# Altium project Sitara_Project_Rev_A.PrjPcb (part 1 of 3)
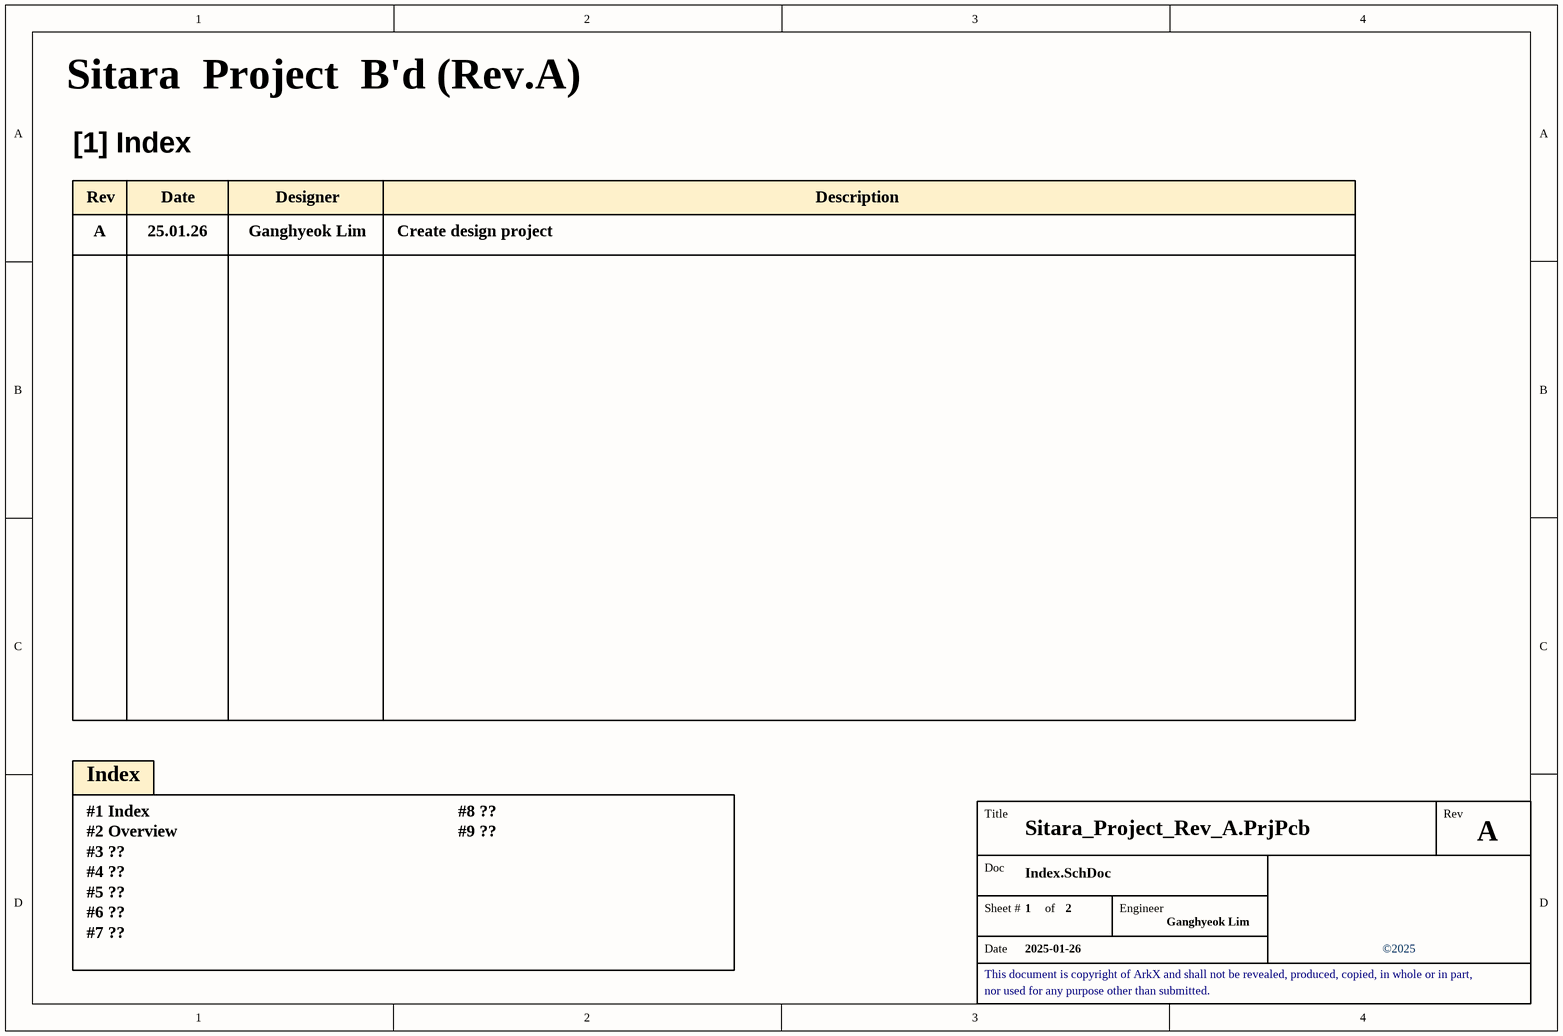
[diagram p0: Index.SchDoc]
11 sheets, 515 parts. Net scope: flat (ports and power ports of the same name join across sheets).
Board file: Sitara_Project_Rev_A.PcbDoc
Sheets:
  Index.SchDoc
  Overview.SchDoc
  Power.SchDoc
  Sitara_Power.SchDoc
  Sitara_AUX.SchDoc
  Sitara_DDR.SchDoc
  Sitara_IO_Bank_123.SchDoc
  Sitara_IO_Bank_45.SchDoc
  Sitara_IO_Bank_6.SchDoc
  Sitara_Connectors.SchDoc
  Sch_Design_Check_List.SchDoc

## Sheet Index.SchDoc
size A4; Date: 2025-01-26; Engineer: Ganghyeok Lim; Revision: A; SheetNumber: 1; SheetTotal: 2

### Notes on the sheet
- Sitara  Project  B'd (Rev.A)
- [1] Index
- Rev
- A
- 25.01.26
- Date
- Ganghyeok Lim
- Designer
- Create design project
- Description
- Index
- #1 Index
- #2 Overview
- #8 ??
- #9 ??
- #3 ??
- #4 ??
- #5 ??
- #6 ??
- #7 ??
- Title
- Doc
- Sheet #
- of
- Engineer
- This document is copyright of ArkX and shall not be revealed, produced, copied, in whole or in part,
- ©2025
- nor used for any purpose other than submitted.

## Sheet Overview.SchDoc
size A4; Date: 2025-01-26; Engineer: Ganghyeok Lim; Revision: A; SheetNumber: 2; SheetTotal: 2
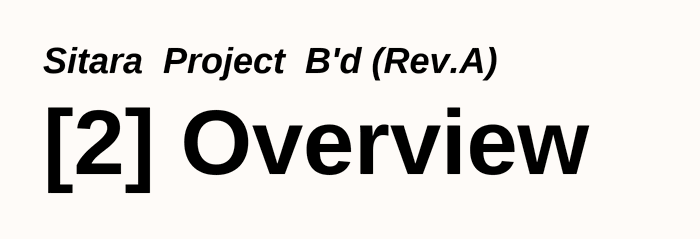
[diagram p1: Overview.SchDoc]

### Notes on the sheet
- Sitara  Project  B'd (Rev.A)
- [2] Overview
- Title
- Rev
- Doc
- Sheet #
- of
- Engineer
- This document is copyright of ArkX and shall not be revealed, produced, copied, in whole or in part,
- Date
- nor used for any purpose other than submitted.

## Sheet Power.SchDoc
size A3; SheetNumber: 3; SheetTotal: 11
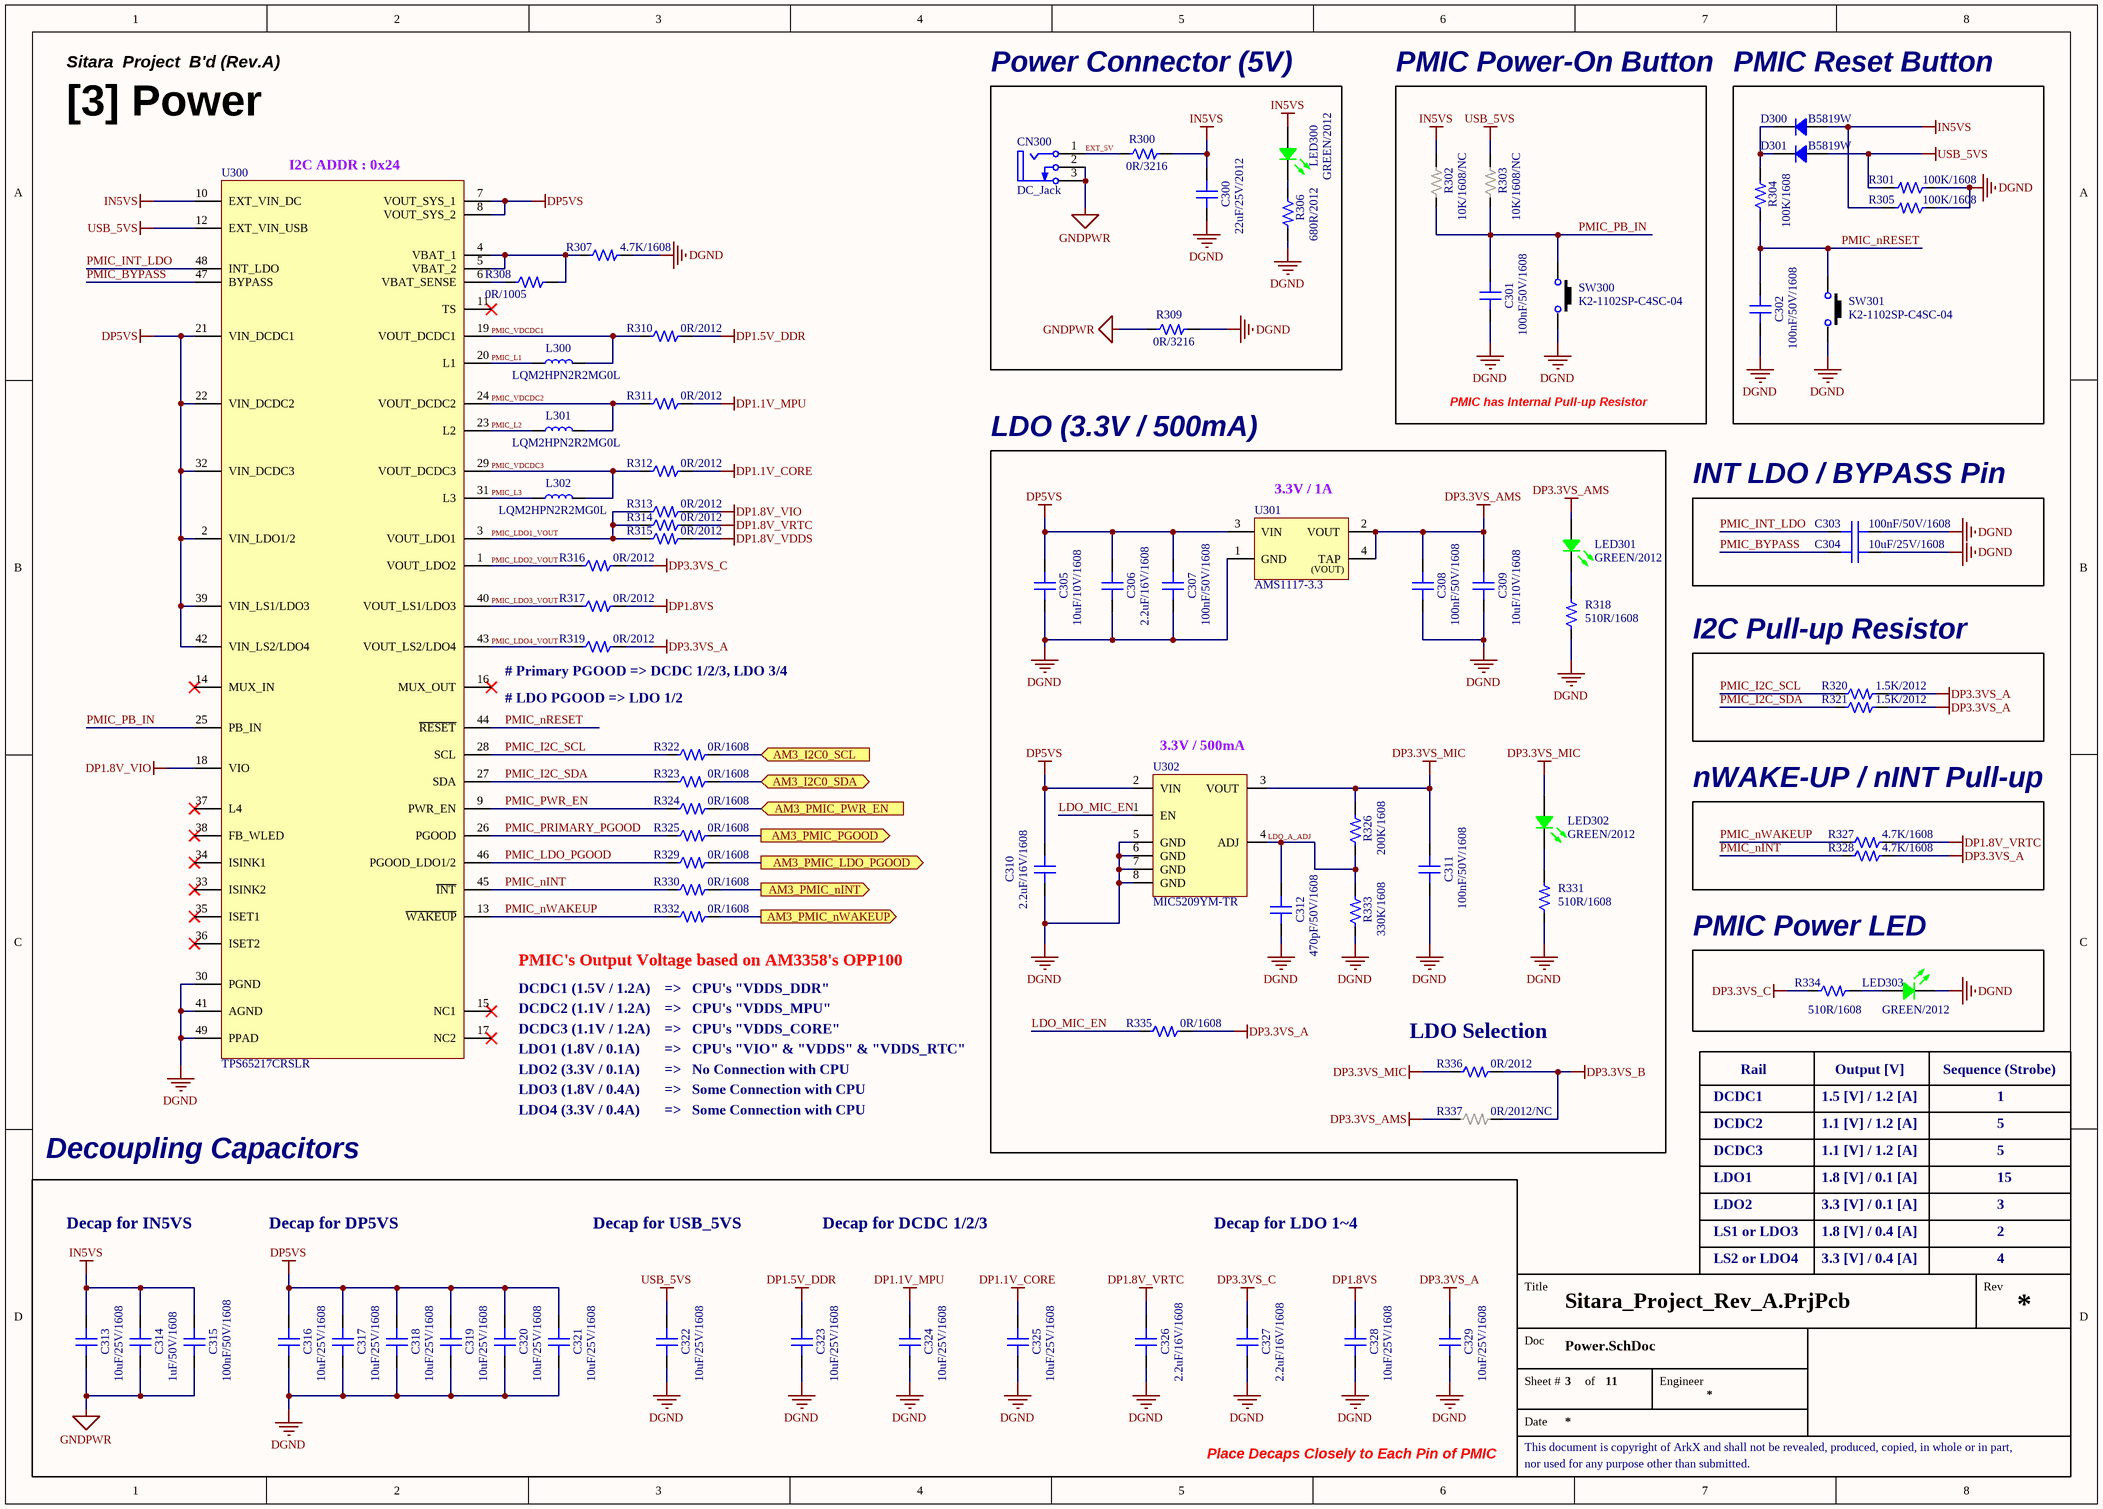
[diagram p2: Power.SchDoc]

### Parts
C300  22uF/25V/2012  [CAP 2012 (0805_INCH)]
C301  100nF/50V/1608  [CAP 1608 (0603_INCH)]
C302  100nF/50V/1608  [CAP 1608 (0603_INCH)]
C303  100nF/50V/1608  [CAP 1608 (0603_INCH)]
C304  10uF/25V/1608  [CAP 1608 (0603_INCH)]
C305  10uF/10V/1608  [CAP 1608 (0603_INCH)]
C306  2.2uF/16V/1608  [CAP 1608 (0603_INCH)]
C307  100nF/50V/1608  [CAP 1608 (0603_INCH)]
C308  100nF/50V/1608  [CAP 1608 (0603_INCH)]
C309  10uF/10V/1608  [CAP 1608 (0603_INCH)]
C310  2.2uF/16V/1608  [CAP 1608 (0603_INCH)]
C311  100nF/50V/1608  [CAP 1608 (0603_INCH)]
C312  470pF/50V/1608  [CAP 1608 (0603_INCH)]
C313  10uF/25V/1608  [CAP 1608 (0603_INCH)]
C314  1uF/50V/1608  [CAP 1608 (0603_INCH)]
C315  100nF/50V/1608  [CAP 1608 (0603_INCH)]
C316  10uF/25V/1608  [CAP 1608 (0603_INCH)]
C317  10uF/25V/1608  [CAP 1608 (0603_INCH)]
C318  10uF/25V/1608  [CAP 1608 (0603_INCH)]
C319  10uF/25V/1608  [CAP 1608 (0603_INCH)]
C320  10uF/25V/1608  [CAP 1608 (0603_INCH)]
C321  10uF/25V/1608  [CAP 1608 (0603_INCH)]
C322  10uF/25V/1608  [CAP 1608 (0603_INCH)]
C323  10uF/25V/1608  [CAP 1608 (0603_INCH)]
C324  10uF/25V/1608  [CAP 1608 (0603_INCH)]
C325  10uF/25V/1608  [CAP 1608 (0603_INCH)]
C326  2.2uF/16V/1608  [CAP 1608 (0603_INCH)]
C327  2.2uF/16V/1608  [CAP 1608 (0603_INCH)]
C328  10uF/25V/1608  [CAP 1608 (0603_INCH)]
C329  10uF/25V/1608  [CAP 1608 (0603_INCH)]
CN300  DC_Jack  [CON_DC-JACK]
D300  B5819W  [DIO_SOD-123]
D301  B5819W  [DIO_SOD-123]
L300  LQM2HPN2R2MG0L  [IND_LQM2HPN2R2MG0L]
L301  LQM2HPN2R2MG0L  [IND_LQM2HPN2R2MG0L]
L302  LQM2HPN2R2MG0L  [IND_LQM2HPN2R2MG0L]
LED300  GREEN/2012  [LED MHT170RGBCT (GREEN)]
LED301  GREEN/2012  [LED MHT170RGBCT (GREEN)]
LED302  GREEN/2012  [LED MHT170RGBCT (GREEN)]
LED303  GREEN/2012  [LED MHT170RGBCT (GREEN)]
R300  0R/3216  [RES 3216 (1206_inch)]
R301  100K/1608  [RES 1608 (0603_inch)]
R302  10K/1608/NC  [RES 1608 (0603_inch)/NC]
R303  10K/1608/NC  [RES 1608 (0603_inch)/NC]
R304  100K/1608  [RES 1608 (0603_inch)]
R305  100K/1608  [RES 1608 (0603_inch)]
R306  680R/2012  [RES 2012 (0805_inch)]
R307  4.7K/1608  [RES 1608 (0603_inch)]
R308  0R/1005  [RES 1005 (0402_inch)]
R309  0R/3216  [RES 3216 (1206_inch)]
R310  0R/2012  [RES 2012 (0805_inch)]
R311  0R/2012  [RES 2012 (0805_inch)]
R312  0R/2012  [RES 2012 (0805_inch)]
R313  0R/2012  [RES 2012 (0805_inch)]
R314  0R/2012  [RES 2012 (0805_inch)]
R315  0R/2012  [RES 2012 (0805_inch)]
R316  0R/2012  [RES 2012 (0805_inch)]
R317  0R/2012  [RES 2012 (0805_inch)]
R318  510R/1608  [RES 1608 (0603_inch)]
R319  0R/2012  [RES 2012 (0805_inch)]
R320  1.5K/2012  [RES 2012 (0805_inch)]
R321  1.5K/2012  [RES 2012 (0805_inch)]
R322  0R/1608  [RES 1608 (0603_inch)]
R323  0R/1608  [RES 1608 (0603_inch)]
R324  0R/1608  [RES 1608 (0603_inch)]
R325  0R/1608  [RES 1608 (0603_inch)]
R326  200K/1608  [RES 1608 (0603_inch)]
R327  4.7K/1608  [RES 1608 (0603_inch)]
R328  4.7K/1608  [RES 1608 (0603_inch)]
R329  0R/1608  [RES 1608 (0603_inch)]
R330  0R/1608  [RES 1608 (0603_inch)]
R331  510R/1608  [RES 1608 (0603_inch)]
R332  0R/1608  [RES 1608 (0603_inch)]
R333  330K/1608  [RES 1608 (0603_inch)]
R334  510R/1608  [RES 1608 (0603_inch)]
R335  0R/1608  [RES 1608 (0603_inch)]
R336  0R/2012  [RES 2012 (0805_inch)]
R337  0R/2012/NC  [RES 2012 (0805_INCH)/NC]
SW300  K2-1102SP-C4SC-04  [SW K2-1102SP-C4SC-04]
SW301  K2-1102SP-C4SC-04  [SW K2-1102SP-C4SC-04]
U300  TPS65217CRSLR  [IC_VQFN-48(6x6)]
U301  AMS1117-3.3  [SOT 223-3 (DIODES INCORPORATED)]
U302  MIC5209YM-TR  [IC_SOIC-8 (4.90x3.90mm)]

### Blocks framed on the sheet
Power Connector (5V): C300 CN300 LED300 R300 R306 R309
PMIC Power-On Button: C301 R302 R303 SW300
PMIC Reset Button: C302 D300 D301 R301 R304 R305 SW301
LDO (3.3V / 500mA): C305-C312 LED301 LED302 R318 R326 R331 R333 R335-R337 U301 U302
INT LDO / BYPASS Pin: C303 C304
I2C Pull-up Resistor: R320 R321
nWAKE-UP / nINT Pull-up: R327 R328
PMIC Power LED: LED303 R334
Decoupling Capacitors: C313-C329

### Ports
AM3_I2C0_SCL (in), AM3_I2C0_SDA (bidir), AM3_PMIC_LDO_PGOOD (out), AM3_PMIC_nINT (out), AM3_PMIC_nWAKEUP (out), AM3_PMIC_PGOOD (out), AM3_PMIC_PWR_EN (in)

### Nets
DGND: C300.1 C301.1 C302.1 C303.1 C304.1 C305.1 C306.1 C307.1 C308.1 C309.1 C310.1 C311.1 C312.1 C316.1 C317.1 C318.1 C319.1 C320.1 C321.1 C322.1 C323.1 C324.1 C325.1 C326.1 C327.1 C328.1 C329.1 LED303.2(GREEN) R301.1 R305.1 R306.2 R307.2 R309.2 R318.1 R331.1 R333.1 SW300.3 SW301.3 U300.30(PGND) U300.41(AGND) U300.49(PPAD) U301.1(GND) U302.5(GND) U302.6(GND) U302.7(GND) U302.8(GND)
DP1.1V_CORE: C325.2 R312.2
DP1.1V_MPU: C324.2 R311.2
DP1.5V_DDR: C323.2 R310.2
DP1.8V_VDDS: R315.2
DP1.8V_VIO: R313.2 U300.18(VIO)
DP1.8V_VRTC: C326.2 R314.2 R327.2
DP1.8VS: C328.2 R317.2
DP3.3VS_A: C329.2 R319.2 R320.2 R321.2 R328.2 R335.2
DP3.3VS_AMS: C308.2 C309.2 LED301.4(Common_Anode) R337.1 U301.2(VOUT) U301.4(TAP)
DP3.3VS_B: R336.2 R337.2
DP3.3VS_C: C327.2 R316.2 R334.1
DP3.3VS_MIC: C311.2 LED302.4(Common_Anode) R326.2 R336.1 U302.3(VOUT)
DP5VS: C305.2 C306.2 C307.2 C310.2 C316.2 C317.2 C318.2 C319.2 C320.2 C321.2 U300.2(VIN_LDO1/2) U300.7(VOUT_SYS_1) U300.8(VOUT_SYS_2) U300.21(VIN_DCDC1) U300.22(VIN_DCDC2) U300.32(VIN_DCDC3) U300.39(VIN_LS1/LDO3) U300.42(VIN_LS2/LDO4) U301.3(VIN) U302.2(VIN)
GNDPWR: C313.1 C314.1 C315.1 CN300.2(GND) CN300.3(GND) R309.1
IN5VS: C300.2 C313.2 C314.2 C315.2 D300.1 LED300.4(Common_Anode) R300.2 R302.2 R305.2 U300.10(EXT_VIN_DC)
USB_5VS: C322.2 D301.1 R301.2 R303.2 U300.12(EXT_VIN_USB)
AM3_I2C0_SCL: R322.2 ; port AM3_I2C0_SCL
AM3_I2C0_SDA: R323.2 ; port AM3_I2C0_SDA
AM3_PMIC_LDO_PGOOD: R329.2 ; port AM3_PMIC_LDO_PGOOD
AM3_PMIC_nINT: R330.2 ; port AM3_PMIC_nINT
AM3_PMIC_nWAKEUP: R332.2 ; port AM3_PMIC_nWAKEUP
AM3_PMIC_PGOOD: R325.2 ; port AM3_PMIC_PGOOD
AM3_PMIC_PWR_EN: R324.2 ; port AM3_PMIC_PWR_EN
EXT_5V: CN300.1(VCC) R300.1
LDO_A_ADJ: C312.2 R326.1 R333.2 U302.4(ADJ)
LDO_MIC_EN: R335.1 U302.1(EN)
PMIC_BYPASS: C304.2 U300.47(BYPASS)
PMIC_I2C_SCL: R320.1 R322.1 U300.28(SCL)
PMIC_I2C_SDA: R321.1 R323.1 U300.27(SDA)
PMIC_INT_LDO: C303.2 U300.48(INT_LDO)
PMIC_L1: L300.1 U300.20(L1)
PMIC_L2: L301.1 U300.23(L2)
PMIC_L3: L302.1 U300.31(L3)
PMIC_LDO1_VOUT: R313.1 R314.1 R315.1 U300.3(VOUT_LDO1)
PMIC_LDO2_VOUT: R316.1 U300.1(VOUT_LDO2)
PMIC_LDO3_VOUT: R317.1 U300.40(VOUT_LS1/LDO3)
PMIC_LDO4_VOUT: R319.1 U300.43(VOUT_LS2/LDO4)
PMIC_LDO_PGOOD: R329.1 U300.46(PGOOD_LDO1/2)
PMIC_nINT: R328.1 R330.1 U300.45(~{INT})
PMIC_nRESET: C302.2 R304.1 SW301.1 U300.44(~{RESET})
PMIC_nWAKEUP: R327.1 R332.1 U300.13(~{WAKEUP})
PMIC_PB_IN: C301.2 R302.1 R303.1 SW300.1 U300.25(PB_IN)
PMIC_PRIMARY_PGOOD: R325.1 U300.26(PGOOD)
PMIC_PWR_EN: R324.1 U300.9(PWR_EN)
PMIC_VDCDC1: L300.2 R310.1 U300.19(VOUT_DCDC1)
PMIC_VDCDC2: L301.2 R311.1 U300.24(VOUT_DCDC2)
PMIC_VDCDC3: L302.2 R312.1 U300.29(VOUT_DCDC3)
NetD300_2: D300.2 D301.2 R304.2
NetLED300_2: LED300.2(GREEN) R306.1
NetLED301_2: LED301.2(GREEN) R318.2
NetLED302_2: LED302.2(GREEN) R331.2
NetLED303_4: LED303.4(Common_Anode) R334.2
NetR307_1: R307.1 R308.2 U300.4(VBAT_1) U300.5(VBAT_2)
NetR308_1: R308.1 U300.6(VBAT_SENSE)

Not connected (* = marked no-connect by the designer): U300 11(TS)* 14(MUX_IN)* 15(NC1)* 16(MUX_OUT)* 17(NC2)* 33(ISINK2)* 34(ISINK1)* 35(ISET1)* 36(ISET2)* 37(L4)* 38(FB_WLED)*

### Notes on the sheet
- Sitara  Project  B'd (Rev.A)
- [3] Power
- (near U300) I2C ADDR : 0x24
- PMIC has Internal Pull-up Resistor
- (near U301) 3.3V / 1A
- # LDO PGOOD => LDO 1/2
- (near R319) # Primary PGOOD => DCDC 1/2/3, LDO 3/4
- (near U302) 3.3V / 500mA
- DCDC1 (1.5V / 1.2A)    =>   CPU's "VDDS_DDR"
- PMIC's Output Voltage based on AM3358's OPP100
- DCDC2 (1.1V / 1.2A)    =>   CPU's "VDDS_MPU"
- DCDC3 (1.1V / 1.2A)    =>   CPU's "VDDS_CORE"
- LDO1 (1.8V / 0.1A)       =>   CPU's "VIO" & "VDDS" & "VDDS_RTC"
- (near R336) LDO Selection
- LDO2 (3.3V / 0.1A)       =>   No Connection with CPU
- LDO3 (1.8V / 0.4A)       =>   Some Connection with CPU
- LDO4 (3.3V / 0.4A)       =>   Some Connection with CPU
- DCDC1
- DCDC2
- Rail
- 1.5 [V] / 1.2 [A]
- 1.1 [V] / 1.2 [A]
- Output [V]
- Sequence (Strobe)
- 1
- 5
- DCDC3
- LDO1
- 1.8 [V] / 0.1 [A]
- 15
- Decap for IN5VS
- Decap for DP5VS
- Decap for USB_5VS
- Decap for DCDC 1/2/3
- Decap for LDO 1~4
- LDO2
- LS1 or LDO3
- LS2 or LDO4
- 3.3 [V] / 0.1 [A]
- 1.8 [V] / 0.4 [A]
- 3.3 [V] / 0.4 [A]
- 3
- 2
- 4
- Place Decaps Closely to Each Pin of PMIC
- Title
- Rev
- Doc
- Sheet #
- of
- Engineer
- This document is copyright of ArkX and shall not be revealed, produced, copied, in whole or in part,
- Date
- nor used for any purpose other than submitted.
- (in symbol IC_REG_AMS1117-3.3) (VOUT)

### Library data of the parts
C300 = CAP_22uF/25V/2012: Ceramic CAP_22uF/25V/2012; LCSC Part #: C45783; JLCPCB Part Type: Basic Part
C301-C303 C307 C308 C311 C315 = CAP_100nF/50V/1608: Ceramic CAP_100nF/50V/1608; LCSC Part #: C14663; JLCPCB Part Type: Basic Part
C304 C313 C316-C325 C328 C329 = CAP_10uF/25V/1608: Ceramic CAP_10uF/25V/1608; LCSC Part #: C96446; JLCPCB Part Type: Basic Part
C305 C309 = CAP_10uF/10V/1608: Ceramic CAP_10uF/10V/1608; LCSC Part #: C19702; JLCPCB Part Type: Basic Part
C306 C310 C326 C327 = CAP_2.2uF/16V/1608: Ceramic CAP_2.2uF/16V/1608; LCSC Part #: C23630; JLCPCB Part Type: Basic Part
C312 = CAP_470pF/50V/1608: Ceramic CAP_470pF/50V/1608; LCSC Part #: C1620; JLCPCB Part Type: Basic Part
C314 = CAP_1uF/50V/1608: Ceramic CAP_1uF/50V/1608; LCSC Part #: C15849; JLCPCB Part Type: Basic Part
CN300 = CON_DC-Jack: ComponentLink1Description: Manufacturer Link; ComponentLink1URL: http://www.cliffuk.co.uk/
D300 D301 = DIO_B5819W: 40V 600mV@1A 1A SOD-123  Schottky Barrier Diodes (SBD) ROHS; LCSC Part #: C8598; JLCPCB Part Type: Basic Part
L300-L302 = IND_LQM2HPN2R2MG0L: 2.2 µH Shielded Multilayer Inductor 1.3 A 100mOhm Max 1008 (2520 Metric); LCSC Part #: C86092; JLCPCB Part Type: Extended Part
LED300-LED303 = LED_MHT170RGBCT(GREEN): Colorless transparence -30℃~+85℃ Positive post Common anode RGB 120° 0805  Light Emitting Diodes (LED) ROHS; LCSC Part #: C2962094; JLCPCB Part Type: Extended Part
R300 R309 = RES_0R/3216/0.25W: Power Rating: 0.1W; Precision: 1%; Size: 1608; LCSC Part #: C17888; JLCPCB Part Type: Basic Part
R301 R304 R305 = RES_100K/1608/0.1W: Value: 100K; Power Rating: 0.1W; Precision: 1%; Size: 1608; LCSC Part #: C25803; JLCPCB Part Type: Basic Part
R302 R303 = RES_NC_10K/1608/0.1W: RES_10K/1608/0.1W; Value: 10K; Power Rating: 0.1W; Precision: 1%; Size: 1608
R306 = RES_680R/2012/0.125W: Value: 680R; Power Rating: 0.125W; Precision: 1%; Size: 2012; LCSC Part #: C17798; JLCPCB Part Type: Basic Part
R307 R327 R328 = RES_4.7K/1608/0.1W: Value: 4.7K; Power Rating: 0.1W; Precision: 1%; Size: 1608; LCSC Part #: C23162; JLCPCB Part Type: Basic Part
R308 = RES_0R/1005/62.5mW: Value: 0R; Power Rating: 62.5mW; Precision: 1%; Size: 1005; LCSC Part #: C17168; JLCPCB Part Type: Basic Part
R310-R317 R319 R336 = RES_0R/2012/0.125W: Value: 0R; Power Rating: 0.125W; Precision: 1%; Size: 2012; LCSC Part #: C17477; JLCPCB Part Type: Basic Part
R318 R331 R334 = RES_510R/1608/0.1W: Value: 510R; Power Rating: 0.1W; Precision: 1%; Size: 1608; LCSC Part #: C23193; JLCPCB Part Type: Basic Part
R320 R321 = RES_1.5K/2012/0.125W: Value: 1.5K; Power Rating: 0.125W; Precision: 1%; Size: 2012; LCSC Part #: C4310; JLCPCB Part Type: Basic Part
R322-R325 R329 R330 R332 R335 = RES_0R/1608/0.1W: Value: 0R; Power Rating: 0.1W; Precision: 1%; Size: 1608; LCSC Part #: C21189; JLCPCB Part Type: Basic Part
R326 = RES_200K/1608/0.1W: Value: 200K; Power Rating: 0.1W; Precision: 1%; Size: 1608; LCSC Part #: C25811; JLCPCB Part Type: Basic Part
R333 = RES_330K/1608/0.1W: Value: 330K; Power Rating: 0.1W; Precision: 1%; Size: 1608; LCSC Part #: C23137; JLCPCB Part Type: Basic Part
R337 = RES_NC_0R/2012/0.125W: 0R/2012/0.125W/NC; Value: 0R; Power Rating: 0.1W; Precision: 1%; Size: 1608
SW300 SW301 = SW_K2-1102SP-C4SC-04(2P): -25℃~+85℃ 6mm 5mm Round Button 50mA Brick nogging 6mm SPST 100MΩ 100000 250gf@±30gf 12V SMD  Tactile Switches ROHS; LCSC Part #: C127509; JLCPCB Part Type: Extended Part
U300 = IC_PMIC_TPS65217CRSLR: Battery Management, Display (LED Drivers), Handheld/Mobile Devices, Power Supply PMIC 48-VQFN (6x6); LCSC Part #: C116081; JLCPCB Part Type: Extended Part
U301 = IC_REG_AMS1117-3.3: 72dB@(120Hz) 1A 1.3V@(800mA) Fixed 3.3V~3.3V Positive 1 SOT-223  Linear Voltage Regulators (LDO) ROHS; LCSC Part #: C6186; JLCPCB Part Type: Basic Part
U302 = IC_REG_MIC5209YM-TR: Linear Voltage Regulator IC Positive Adjustable 1 Output 500mA 8-SOIC; LCSC Part #: C461593; JLCPCB Part Type: Extended Part

## Sheet Sitara_Power.SchDoc
size A3; SheetNumber: 4; SheetTotal: 11
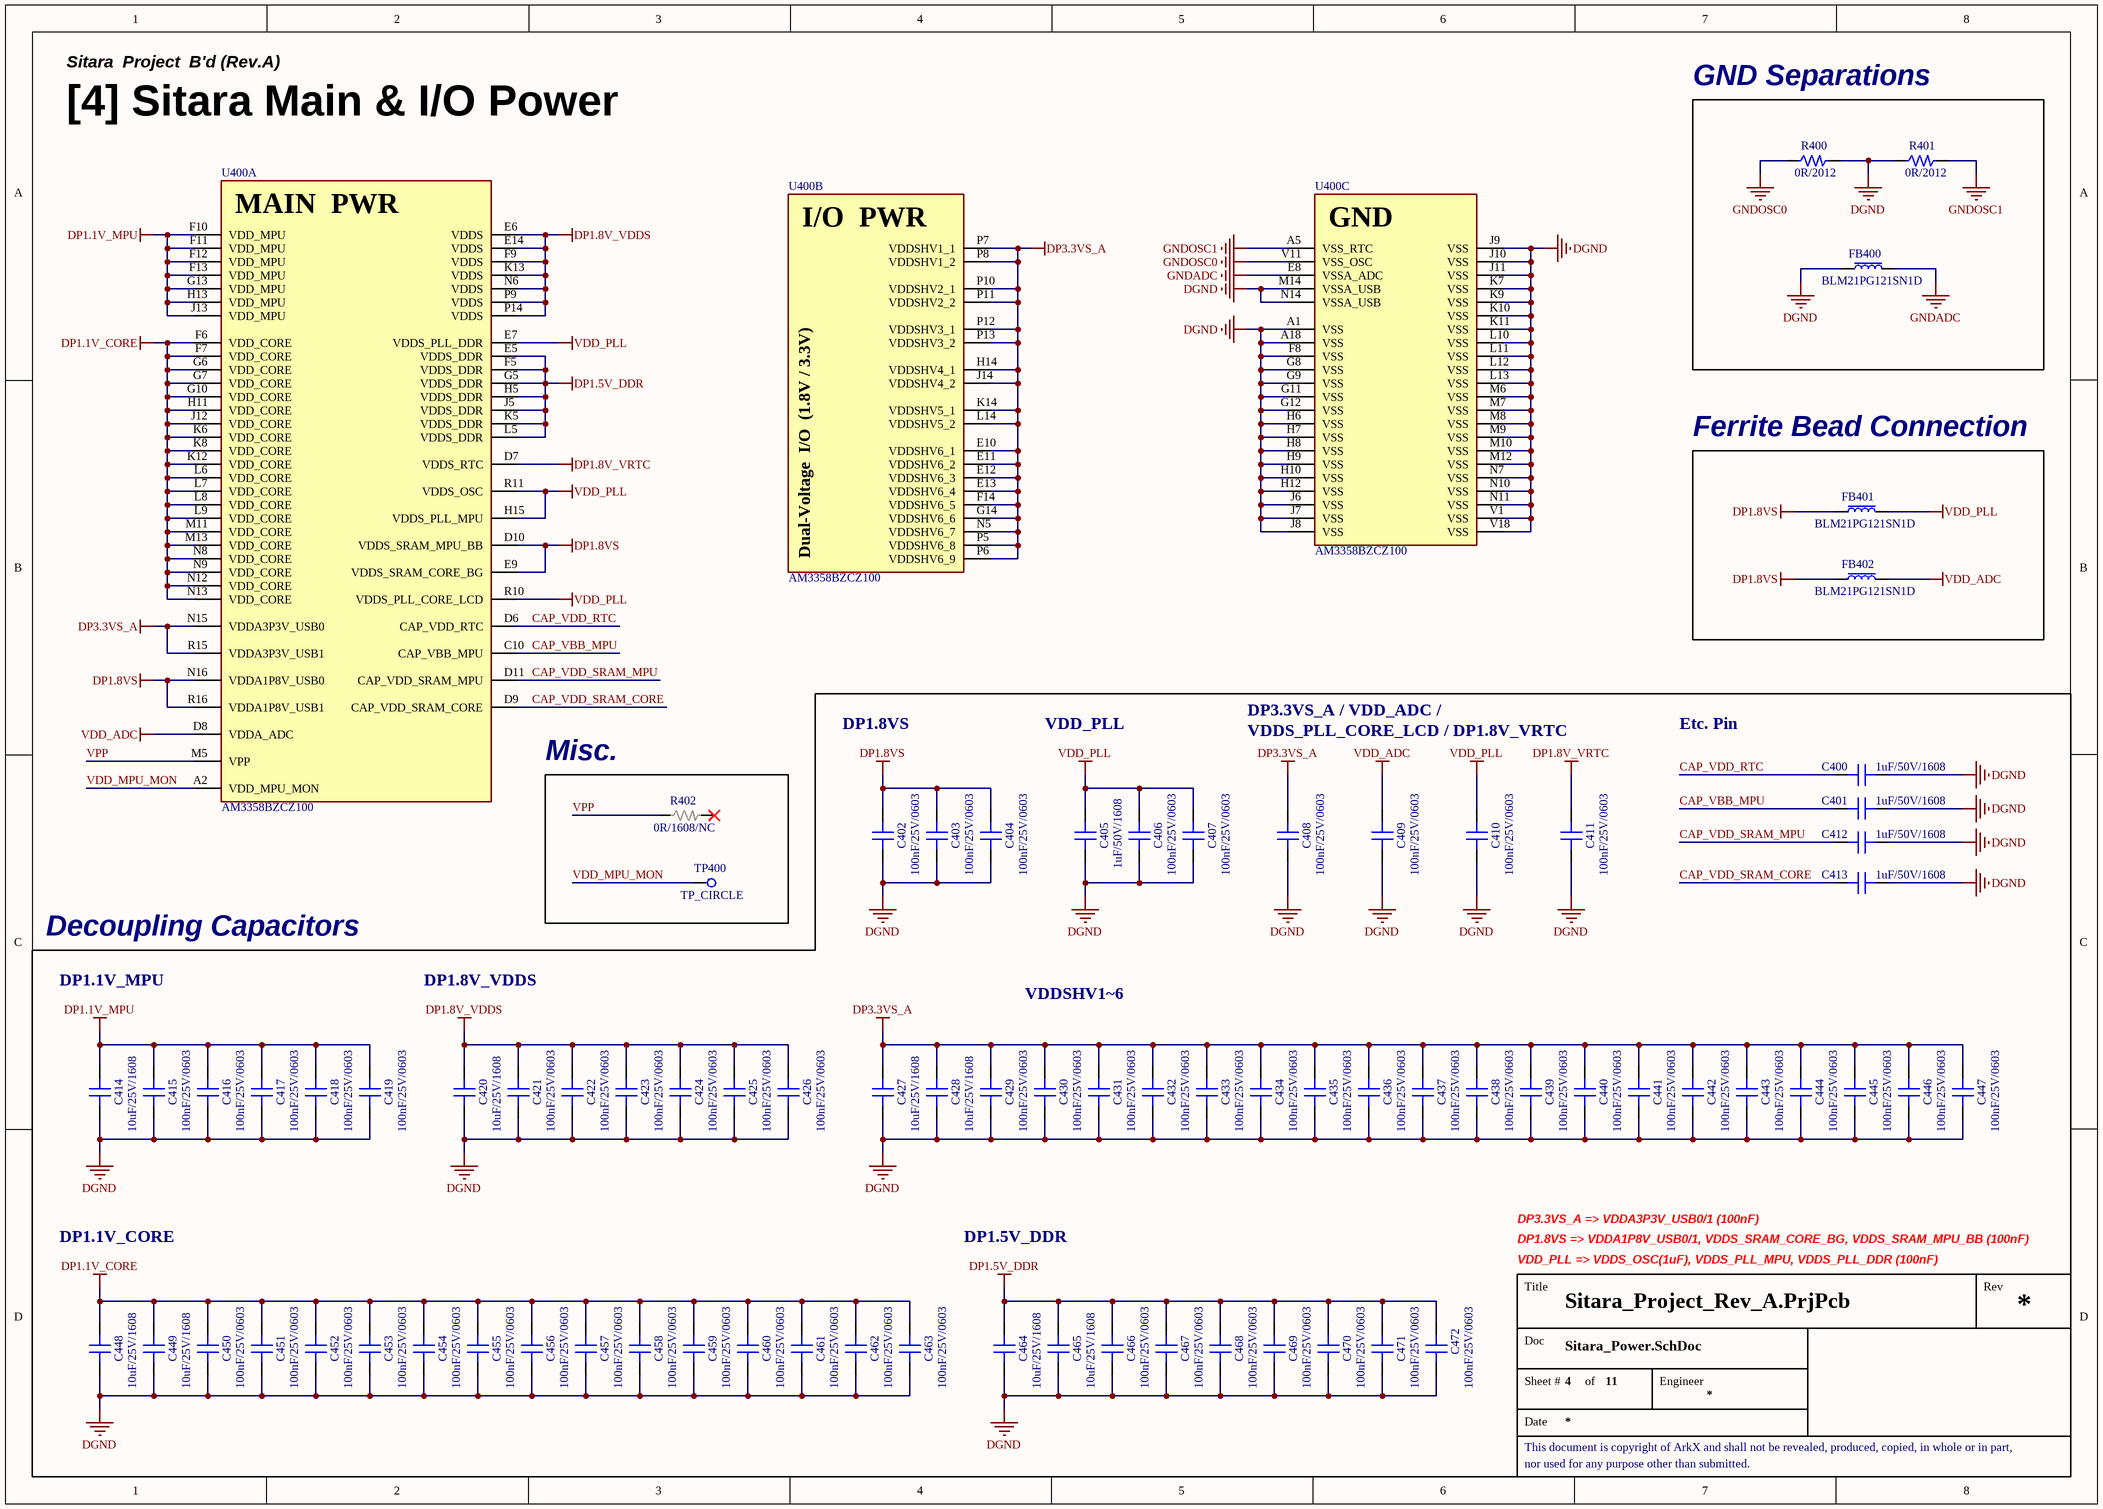
[diagram p3: Sitara_Power.SchDoc]

### Parts
C400  1uF/50V/1608  [CAP 1608 (0603_INCH)]
C401  1uF/50V/1608  [CAP 1608 (0603_INCH)]
C402  100nF/25V/0603  [CAP 0603 (0201_INCH)]
C403  100nF/25V/0603  [CAP 0603 (0201_INCH)]
C404  100nF/25V/0603  [CAP 0603 (0201_INCH)]
C405  1uF/50V/1608  [CAP 1608 (0603_INCH)]
C406  100nF/25V/0603  [CAP 0603 (0201_INCH)]
C407  100nF/25V/0603  [CAP 0603 (0201_INCH)]
C408  100nF/25V/0603  [CAP 0603 (0201_INCH)]
C409  100nF/25V/0603  [CAP 0603 (0201_INCH)]
C410  100nF/25V/0603  [CAP 0603 (0201_INCH)]
C411  100nF/25V/0603  [CAP 0603 (0201_INCH)]
C412  1uF/50V/1608  [CAP 1608 (0603_INCH)]
C413  1uF/50V/1608  [CAP 1608 (0603_INCH)]
C414  10uF/25V/1608  [CAP 1608 (0603_INCH)]
C415  100nF/25V/0603  [CAP 0603 (0201_INCH)]
C416  100nF/25V/0603  [CAP 0603 (0201_INCH)]
C417  100nF/25V/0603  [CAP 0603 (0201_INCH)]
C418  100nF/25V/0603  [CAP 0603 (0201_INCH)]
C419  100nF/25V/0603  [CAP 0603 (0201_INCH)]
C420  10uF/25V/1608  [CAP 1608 (0603_INCH)]
C421  100nF/25V/0603  [CAP 0603 (0201_INCH)]
C422  100nF/25V/0603  [CAP 0603 (0201_INCH)]
C423  100nF/25V/0603  [CAP 0603 (0201_INCH)]
C424  100nF/25V/0603  [CAP 0603 (0201_INCH)]
C425  100nF/25V/0603  [CAP 0603 (0201_INCH)]
C426  100nF/25V/0603  [CAP 0603 (0201_INCH)]
C427  10uF/25V/1608  [CAP 1608 (0603_INCH)]
C428  10uF/25V/1608  [CAP 1608 (0603_INCH)]
C429  100nF/25V/0603  [CAP 0603 (0201_INCH)]
C430  100nF/25V/0603  [CAP 0603 (0201_INCH)]
C431  100nF/25V/0603  [CAP 0603 (0201_INCH)]
C432  100nF/25V/0603  [CAP 0603 (0201_INCH)]
C433  100nF/25V/0603  [CAP 0603 (0201_INCH)]
C434  100nF/25V/0603  [CAP 0603 (0201_INCH)]
C435  100nF/25V/0603  [CAP 0603 (0201_INCH)]
C436  100nF/25V/0603  [CAP 0603 (0201_INCH)]
C437  100nF/25V/0603  [CAP 0603 (0201_INCH)]
C438  100nF/25V/0603  [CAP 0603 (0201_INCH)]
C439  100nF/25V/0603  [CAP 0603 (0201_INCH)]
C440  100nF/25V/0603  [CAP 0603 (0201_INCH)]
C441  100nF/25V/0603  [CAP 0603 (0201_INCH)]
C442  100nF/25V/0603  [CAP 0603 (0201_INCH)]
C443  100nF/25V/0603  [CAP 0603 (0201_INCH)]
C444  100nF/25V/0603  [CAP 0603 (0201_INCH)]
C445  100nF/25V/0603  [CAP 0603 (0201_INCH)]
C446  100nF/25V/0603  [CAP 0603 (0201_INCH)]
C447  100nF/25V/0603  [CAP 0603 (0201_INCH)]
C448  10uF/25V/1608  [CAP 1608 (0603_INCH)]
C449  10uF/25V/1608  [CAP 1608 (0603_INCH)]
C450  100nF/25V/0603  [CAP 0603 (0201_INCH)]
C451  100nF/25V/0603  [CAP 0603 (0201_INCH)]
C452  100nF/25V/0603  [CAP 0603 (0201_INCH)]
C453  100nF/25V/0603  [CAP 0603 (0201_INCH)]
C454  100nF/25V/0603  [CAP 0603 (0201_INCH)]
C455  100nF/25V/0603  [CAP 0603 (0201_INCH)]
C456  100nF/25V/0603  [CAP 0603 (0201_INCH)]
C457  100nF/25V/0603  [CAP 0603 (0201_INCH)]
C458  100nF/25V/0603  [CAP 0603 (0201_INCH)]
C459  100nF/25V/0603  [CAP 0603 (0201_INCH)]
C460  100nF/25V/0603  [CAP 0603 (0201_INCH)]
C461  100nF/25V/0603  [CAP 0603 (0201_INCH)]
C462  100nF/25V/0603  [CAP 0603 (0201_INCH)]
C463  100nF/25V/0603  [CAP 0603 (0201_INCH)]
C464  10uF/25V/1608  [CAP 1608 (0603_INCH)]
C465  10uF/25V/1608  [CAP 1608 (0603_INCH)]
C466  100nF/25V/0603  [CAP 0603 (0201_INCH)]
C467  100nF/25V/0603  [CAP 0603 (0201_INCH)]
C468  100nF/25V/0603  [CAP 0603 (0201_INCH)]
C469  100nF/25V/0603  [CAP 0603 (0201_INCH)]
C470  100nF/25V/0603  [CAP 0603 (0201_INCH)]
C471  100nF/25V/0603  [CAP 0603 (0201_INCH)]
C472  100nF/25V/0603  [CAP 0603 (0201_INCH)]
FB400  BLM21PG121SN1D  [FB 2012 (0805_inch)]
FB401  BLM21PG121SN1D  [FB 2012 (0805_inch)]
FB402  BLM21PG121SN1D  [FB 2012 (0805_inch)]
R400  0R/2012  [RES 2012 (0805_inch)]
R401  0R/2012  [RES 2012 (0805_inch)]
R402  0R/1608/NC  [RES 1608 (0603_inch)/NC]
TP400  TP_CIRCLE  [TP Circle]
U400  AM3358BZCZ100  [IC_SOC_AM3358BZCZ100]  (parts A,B,C of 8)

### Blocks framed on the sheet
GND Separations: FB400 R400 R401
Ferrite Bead Connection: FB401 FB402
Misc.: R402 TP400

### Nets
DGND: C400.2 C401.2 C402.1 C403.1 C404.1 C405.1 C406.1 C407.1 C408.1 C409.1 C410.1 C411.1 C412.2 C413.2 C414.1 C415.1 C416.1 C417.1 C418.1 C419.1 C420.1 C421.1 C422.1 C423.1 C424.1 C425.1 C426.1 C427.1 C428.1 C429.1 C430.1 C431.1 C432.1 C433.1 C434.1 C435.1 C436.1 C437.1 C438.1 C439.1 C440.1 C441.1 C442.1 C443.1 C444.1 C445.1 C446.1 C447.1 C448.1 C449.1 C450.1 C451.1 C452.1 C453.1 C454.1 C455.1 C456.1 C457.1 C458.1 C459.1 C460.1 C461.1 C462.1 C463.1 C464.1 C465.1 C466.1 C467.1 C468.1 C469.1 C470.1 C471.1 C472.1 FB400.1 R400.2 R401.1 U400.A1(VSS) U400.A18(VSS) U400.F8(VSS) U400.G8(VSS) U400.G9(VSS) U400.G11(VSS) U400.G12(VSS) U400.H6(VSS) U400.H7(VSS) U400.H8(VSS) U400.H9(VSS) U400.H10(VSS) U400.H12(VSS) U400.J6(VSS) U400.J7(VSS) U400.J8(VSS) U400.J9(VSS) U400.J10(VSS) U400.J11(VSS) U400.K7(VSS) U400.K9(VSS) U400.K10(VSS) U400.K11(VSS) U400.L10(VSS) U400.L11(VSS) U400.L12(VSS) U400.L13(VSS) U400.M6(VSS) U400.M7(VSS) U400.M8(VSS) U400.M9(VSS) U400.M10(VSS) U400.M12(VSS) U400.M14(VSSA_USB) U400.N7(VSS) U400.N10(VSS) U400.N11(VSS) U400.N14(VSSA_USB) U400.V1(VSS) U400.V18(VSS)
DP1.1V_CORE: C448.2 C449.2 C450.2 C451.2 C452.2 C453.2 C454.2 C455.2 C456.2 C457.2 C458.2 C459.2 C460.2 C461.2 C462.2 C463.2 U400.F6(VDD_CORE) U400.F7(VDD_CORE) U400.G6(VDD_CORE) U400.G7(VDD_CORE) U400.G10(VDD_CORE) U400.H11(VDD_CORE) U400.J12(VDD_CORE) U400.K6(VDD_CORE) U400.K8(VDD_CORE) U400.K12(VDD_CORE) U400.L6(VDD_CORE) U400.L7(VDD_CORE) U400.L8(VDD_CORE) U400.L9(VDD_CORE) U400.M11(VDD_CORE) U400.M13(VDD_CORE) U400.N8(VDD_CORE) U400.N9(VDD_CORE) U400.N12(VDD_CORE) U400.N13(VDD_CORE)
DP1.1V_MPU: C414.2 C415.2 C416.2 C417.2 C418.2 C419.2 U400.F10(VDD_MPU) U400.F11(VDD_MPU) U400.F12(VDD_MPU) U400.F13(VDD_MPU) U400.G13(VDD_MPU) U400.H13(VDD_MPU) U400.J13(VDD_MPU)
DP1.5V_DDR: C464.2 C465.2 C466.2 C467.2 C468.2 C469.2 C470.2 C471.2 C472.2 U400.E5(VDDS_DDR) U400.F5(VDDS_DDR) U400.G5(VDDS_DDR) U400.H5(VDDS_DDR) U400.J5(VDDS_DDR) U400.K5(VDDS_DDR) U400.L5(VDDS_DDR)
DP1.8V_VDDS: C420.2 C421.2 C422.2 C423.2 C424.2 C425.2 C426.2 U400.E6(VDDS) U400.E14(VDDS) U400.F9(VDDS) U400.K13(VDDS) U400.N6(VDDS) U400.P9(VDDS) U400.P14(VDDS)
DP1.8V_VRTC: C411.2 U400.D7(VDDS_RTC)
DP1.8VS: C402.2 C403.2 C404.2 FB401.1 FB402.1 U400.D10(VDDS_SRAM_MPU_BB) U400.E9(VDDS_SRAM_CORE_BG) U400.N16(VDDA1P8V_USB0) U400.R16(VDDA1P8V_USB1)
DP3.3VS_A: C408.2 C427.2 C428.2 C429.2 C430.2 C431.2 C432.2 C433.2 C434.2 C435.2 C436.2 C437.2 C438.2 C439.2 C440.2 C441.2 C442.2 C443.2 C444.2 C445.2 C446.2 C447.2 U400.E10(VDDSHV6_1) U400.E11(VDDSHV6_2) U400.E12(VDDSHV6_3) U400.E13(VDDSHV6_4) U400.F14(VDDSHV6_5) U400.G14(VDDSHV6_6) U400.H14(VDDSHV4_1) U400.J14(VDDSHV4_2) U400.K14(VDDSHV5_1) U400.L14(VDDSHV5_2) U400.N5(VDDSHV6_7) U400.N15(VDDA3P3V_USB0) U400.P5(VDDSHV6_8) U400.P6(VDDSHV6_9) U400.P7(VDDSHV1_1) U400.P8(VDDSHV1_2) U400.P10(VDDSHV2_1) U400.P11(VDDSHV2_2) U400.P12(VDDSHV3_1) U400.P13(VDDSHV3_2) U400.R15(VDDA3P3V_USB1)
GNDADC: FB400.2 U400.E8(VSSA_ADC)
GNDOSC0: R400.1 U400.V11(VSS_OSC)
GNDOSC1: R401.2 U400.A5(VSS_RTC)
VDD_ADC: C409.2 FB402.2 U400.D8(VDDA_ADC)
VDD_PLL: C405.2 C406.2 C407.2 C410.2 FB401.2 U400.E7(VDDS_PLL_DDR) U400.H15(VDDS_PLL_MPU) U400.R10(VDDS_PLL_CORE_LCD) U400.R11(VDDS_OSC)
CAP_VBB_MPU: C401.1 U400.C10(CAP_VBB_MPU)
CAP_VDD_RTC: C400.1 U400.D6(CAP_VDD_RTC)
CAP_VDD_SRAM_CORE: C413.1 U400.D9(CAP_VDD_SRAM_CORE)
CAP_VDD_SRAM_MPU: C412.1 U400.D11(CAP_VDD_SRAM_MPU)
VDD_MPU_MON: TP400.1(TP) U400.A2(VDD_MPU_MON)
VPP: R402.1 U400.M5(VPP)

Not connected (* = marked no-connect by the designer): R402 2*

### Notes on the sheet
- Sitara  Project  B'd (Rev.A)
- [4] Sitara Main & I/O Power
- DP3.3VS_A / VDD_ADC /
- DP1.8VS
- VDD_PLL
- VDDS_PLL_CORE_LCD / DP1.8V_VRTC
- Etc. Pin
- Decoupling Capacitors
- DP1.1V_MPU
- DP1.8V_VDDS
- VDDSHV1~6
- DP1.1V_CORE
- DP1.5V_DDR
- DP3.3VS_A => VDDA3P3V_USB0/1 (100nF)
- DP1.8VS => VDDA1P8V_USB0/1, VDDS_SRAM_CORE_BG, VDDS_SRAM_MPU_BB (100nF)
- VDD_PLL => VDDS_OSC(1uF), VDDS_PLL_MPU, VDDS_PLL_DDR (100nF)
- Title
- Rev
- Doc
- Sheet #
- of
- Engineer
- This document is copyright of ArkX and shall not be revealed, produced, copied, in whole or in part,
- Date
- nor used for any purpose other than submitted.
- (in symbol IC_SOC_AM3358BZCZ100, part A) MAIN  PWR
- (in symbol IC_SOC_AM3358BZCZ100, part B) I/O  PWR; Dual-Voltage  I/O  (1.8V / 3.3V)
- (in symbol IC_SOC_AM3358BZCZ100, part C) GND

### Library data of the parts
C400 C401 C405 C412 C413 = CAP_1uF/50V/1608: Ceramic CAP_1uF/50V/1608; LCSC Part #: C15849; JLCPCB Part Type: Basic Part
C402-C404 C406-C411 C415-C419 C421-C426 C429-C447 C450-C463 C466-C472 = CAP_100nF/25V/0603: Ceramic CAP_100nF/25V/0603; JLCPCB Part Type: Extended Part; LCSC Part #: C181047
C414 C420 C427 C428 C448 C449 C464 C465 = CAP_10uF/25V/1608: Ceramic CAP_10uF/25V/1608; LCSC Part #: C96446; JLCPCB Part Type: Basic Part
FB400-FB402 = FB_BLM21PG121SN1D: 3A 1 30mΩ 120Ω@100MHz ±25% 0805  Ferrite Beads ROHS; LCSC Part #: C79382; JLCPCB Part Type: Extended Part
R400 R401 = RES_0R/2012/0.125W: as R310 on sheet Power; Size: 2012; LCSC Part #: C17477; JLCPCB Part Type: Basic Part
R402 = RES_NC_0R/1608/0.1W: 0R/1608/0.1W/NC; Value: 0R; Power Rating: 0.1W; Precision: 1%; Size: 1608
U400 = IC_SOC_AM3358BZCZ100: ARM® Cortex®-A8 Microprocessor IC Sitara™ 1 Core, 32-Bit 1.0GHz 324-NFBGA (15x15); LCSC Part #: C73932; JLCPCB Part Type: Extended Part

## Sheet Sitara_AUX.SchDoc
size A3; SheetNumber: 5; SheetTotal: 11
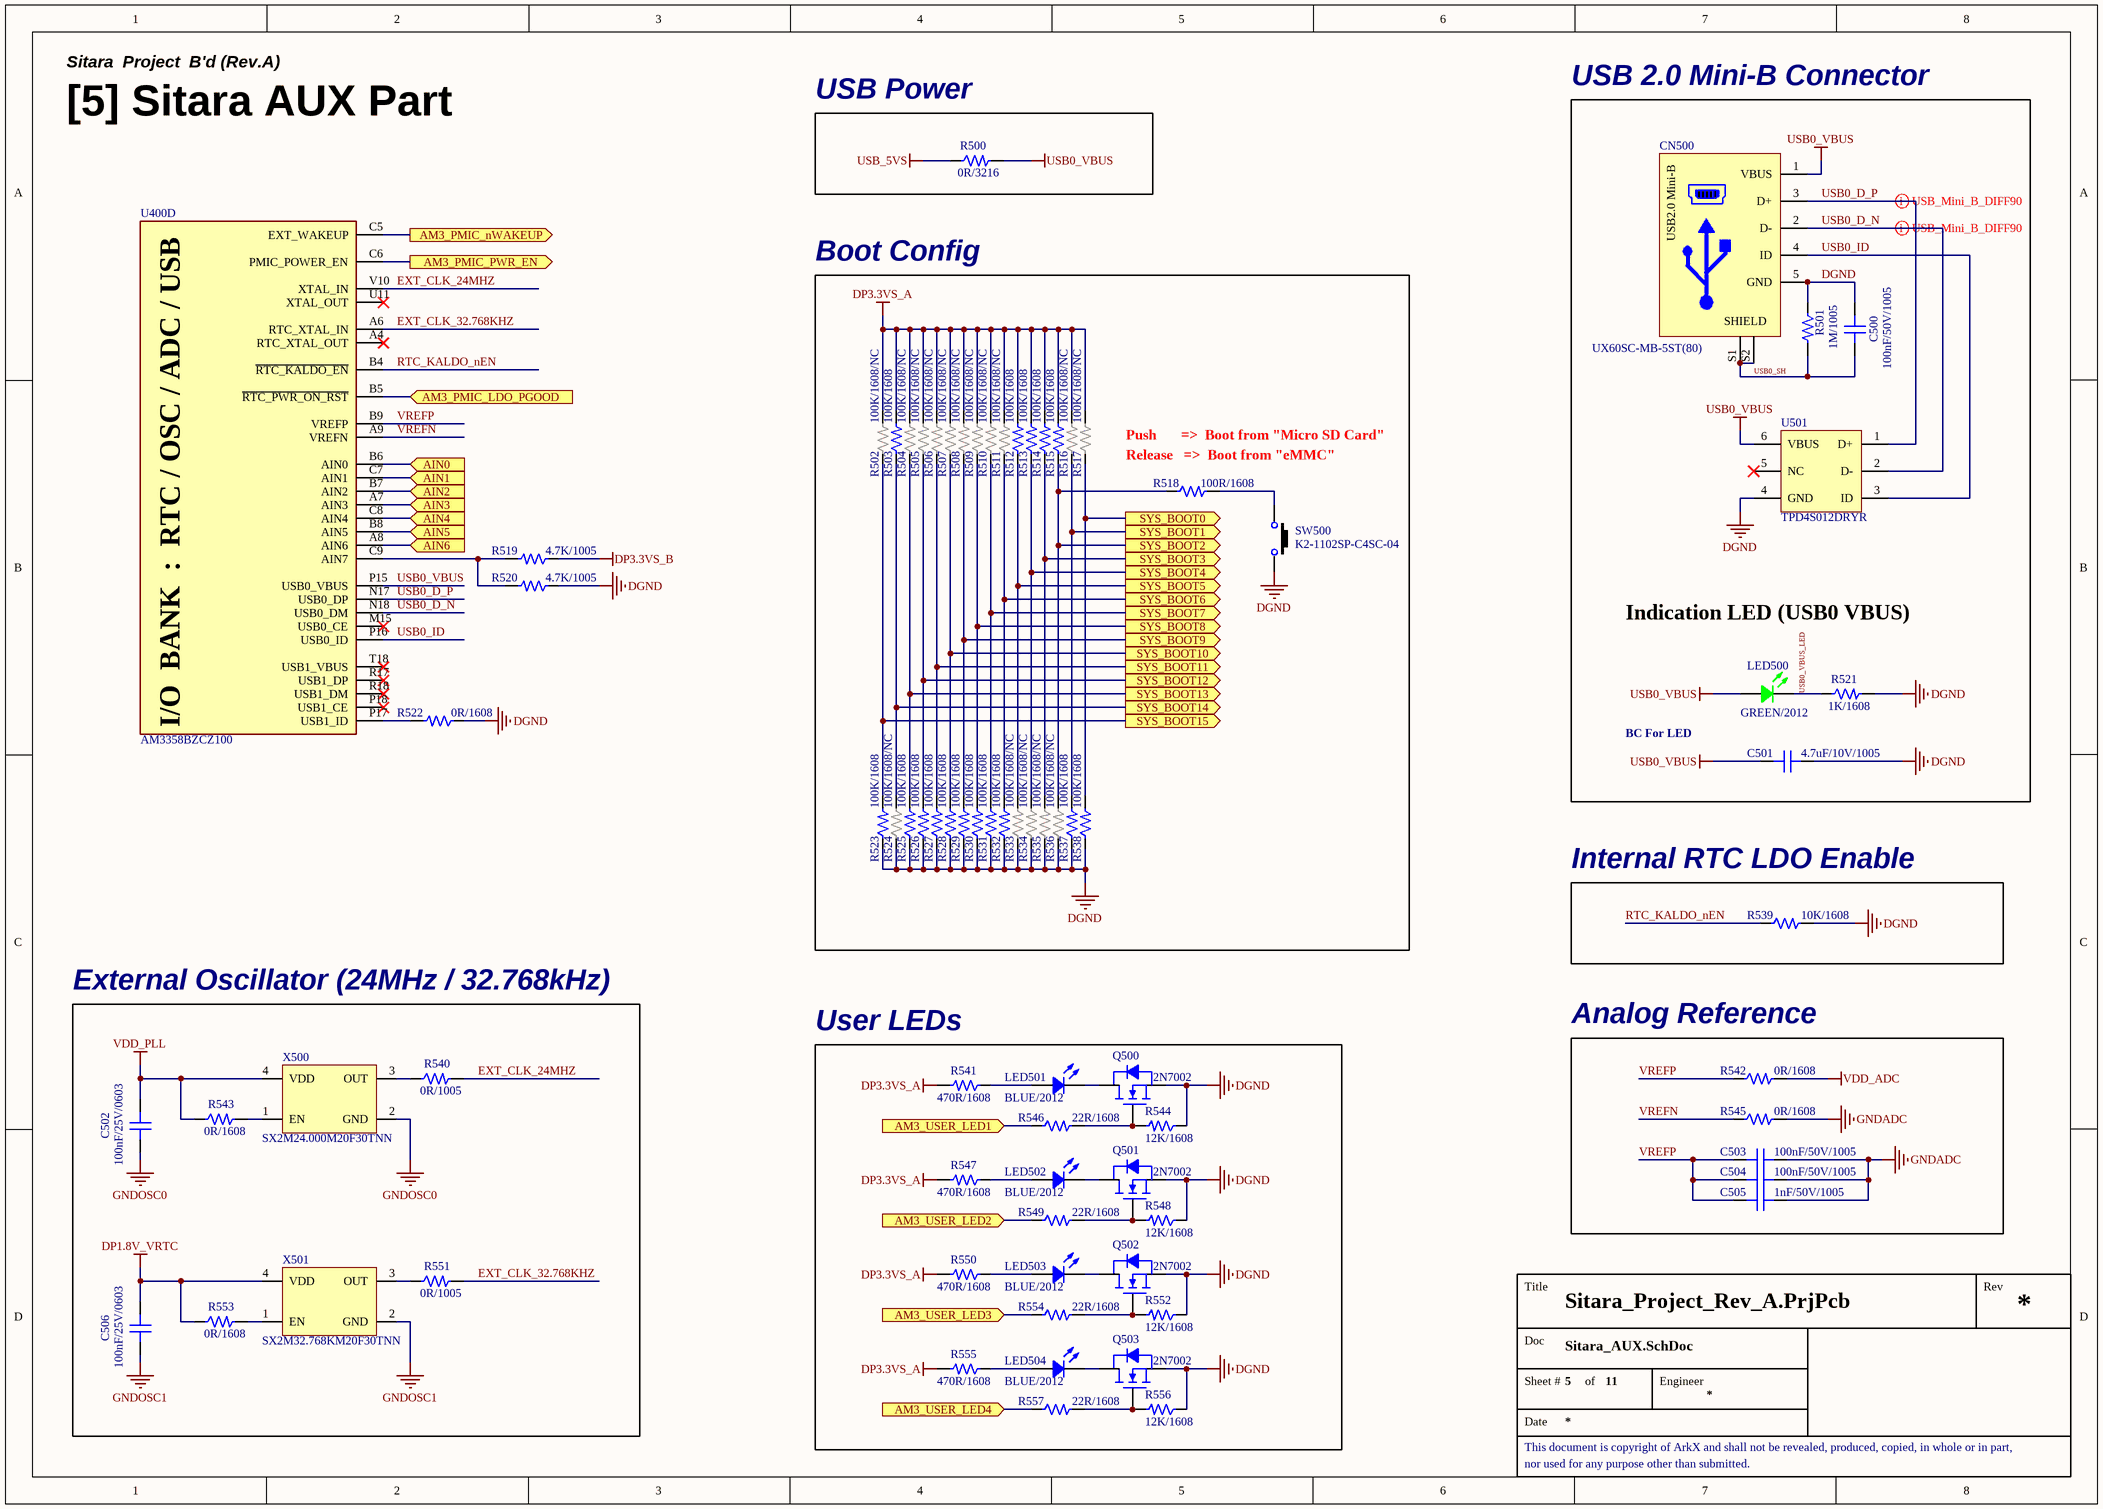
[diagram p4: Sitara_AUX.SchDoc]

### Parts
C500  100nF/50V/1005  [CAP 1005 (0402_INCH)]
C501  4.7uF/10V/1005  [CAP 1005 (0402_INCH)]
C502  100nF/25V/0603  [CAP 0603 (0201_INCH)]
C503  100nF/50V/1005  [CAP 1005 (0402_INCH)]
C504  100nF/50V/1005  [CAP 1005 (0402_INCH)]
C505  1nF/50V/1005  [CAP 1005 (0402_INCH)]
C506  100nF/25V/0603  [CAP 0603 (0201_INCH)]
CN500  UX60SC-MB-5ST(80)  [CON_USB2.0-Mini-B (UX60SC-MB-5ST(80))]
LED500  GREEN/2012  [LED MHT170RGBCT (GREEN)]
LED501  BLUE/2012  [LED MHT170RGBCT (BLUE)]
LED502  BLUE/2012  [LED MHT170RGBCT (BLUE)]
LED503  BLUE/2012  [LED MHT170RGBCT (BLUE)]
LED504  BLUE/2012  [LED MHT170RGBCT (BLUE)]
Q500  2N7002  [SOT 23-3 (DIODES INCORPORATED)]
Q501  2N7002  [SOT 23-3 (DIODES INCORPORATED)]
Q502  2N7002  [SOT 23-3 (DIODES INCORPORATED)]
Q503  2N7002  [SOT 23-3 (DIODES INCORPORATED)]
R500  0R/3216  [RES 3216 (1206_inch)]
R501  1M/1005  [RES 1005 (0402_inch)]
R502  100K/1608/NC  [RES 1608 (0603_inch)/NC]
R503  100K/1608  [RES 1608 (0603_inch)]
R504  100K/1608/NC  [RES 1608 (0603_inch)/NC]
R505  100K/1608/NC  [RES 1608 (0603_inch)/NC]
R506  100K/1608/NC  [RES 1608 (0603_inch)/NC]
R507  100K/1608/NC  [RES 1608 (0603_inch)/NC]
R508  100K/1608/NC  [RES 1608 (0603_inch)/NC]
R509  100K/1608/NC  [RES 1608 (0603_inch)/NC]
R510  100K/1608/NC  [RES 1608 (0603_inch)/NC]
R511  100K/1608/NC  [RES 1608 (0603_inch)/NC]
R512  100K/1608  [RES 1608 (0603_inch)]
R513  100K/1608  [RES 1608 (0603_inch)]
R514  100K/1608  [RES 1608 (0603_inch)]
R515  100K/1608  [RES 1608 (0603_inch)]
R516  100K/1608/NC  [RES 1608 (0603_inch)/NC]
R517  100K/1608/NC  [RES 1608 (0603_inch)/NC]
R518  100R/1608  [RES 1608 (0603_inch)]
R519  4.7K/1005  [RES 1005 (0402_inch)]
R520  4.7K/1005  [RES 1005 (0402_inch)]
R521  1K/1608  [RES 1608 (0603_inch)]
R522  0R/1608  [RES 1608 (0603_inch)]
R523  100K/1608  [RES 1608 (0603_inch)]
R524  100K/1608/NC  [RES 1608 (0603_inch)/NC]
R525  100K/1608  [RES 1608 (0603_inch)]
R526  100K/1608  [RES 1608 (0603_inch)]
R527  100K/1608  [RES 1608 (0603_inch)]
R528  100K/1608  [RES 1608 (0603_inch)]
R529  100K/1608  [RES 1608 (0603_inch)]
R530  100K/1608  [RES 1608 (0603_inch)]
R531  100K/1608  [RES 1608 (0603_inch)]
R532  100K/1608  [RES 1608 (0603_inch)]
R533  100K/1608/NC  [RES 1608 (0603_inch)/NC]
R534  100K/1608/NC  [RES 1608 (0603_inch)/NC]
R535  100K/1608/NC  [RES 1608 (0603_inch)/NC]
R536  100K/1608/NC  [RES 1608 (0603_inch)/NC]
R537  100K/1608  [RES 1608 (0603_inch)]
R538  100K/1608  [RES 1608 (0603_inch)]
R539  10K/1608  [RES 1608 (0603_inch)]
R540  0R/1005  [RES 1005 (0402_inch)]
R541  470R/1608  [RES 1608 (0603_inch)]
R542  0R/1608  [RES 1608 (0603_inch)]
R543  0R/1608  [RES 1608 (0603_inch)]
R544  12K/1608  [RES 1608 (0603_inch)]
R545  0R/1608  [RES 1608 (0603_inch)]
R546  22R/1608  [RES 1608 (0603_inch)]
R547  470R/1608  [RES 1608 (0603_inch)]
R548  12K/1608  [RES 1608 (0603_inch)]
R549  22R/1608  [RES 1608 (0603_inch)]
R550  470R/1608  [RES 1608 (0603_inch)]
R551  0R/1005  [RES 1005 (0402_inch)]
R552  12K/1608  [RES 1608 (0603_inch)]
R553  0R/1608  [RES 1608 (0603_inch)]
R554  22R/1608  [RES 1608 (0603_inch)]
R555  470R/1608  [RES 1608 (0603_inch)]
R556  12K/1608  [RES 1608 (0603_inch)]
R557  22R/1608  [RES 1608 (0603_inch)]
SW500  K2-1102SP-C4SC-04  [SW K2-1102SP-C4SC-04]
U400  AM3358BZCZ100  [IC_SOC_AM3358BZCZ100]  (part D of 8)
U501  TPD4S012DRYR  [IC_SON-6]
X500  SX2M24.000M20F30TNN  [OSC SMD_2.5x2.0 (SCTF)]
X501  SX2M32.768KM20F30TNN  [OSC SMD_2.5x2.0 (SCTF)]

### Blocks framed on the sheet
USB Power: R500
USB 2.0 Mini-B Connector: C500 C501 CN500 LED500 R501 R521 U501
Boot Config: R502-R518 R523-R538 SW500
Internal RTC LDO Enable: R539
External Oscillator (24MHz / 32.768kHz): C502 C506 R540 R543 R551 R553 X500 X501
Analog Reference: C503-C505 R542 R545
User LEDs: LED501-LED504 Q500-Q503 R541 R544 R546-R550 R552 R554-R557

### Ports
AIN0 (in), AIN1 (in), AIN2 (in), AIN3 (in), AIN4 (in), AIN5 (in), AIN6 (in), AM3_PMIC_LDO_PGOOD (in), AM3_PMIC_nWAKEUP (out), AM3_PMIC_PWR_EN (out), AM3_USER_LED1 (in), AM3_USER_LED2 (in), AM3_USER_LED3 (in), AM3_USER_LED4 (in), SYS_BOOT0 (out), SYS_BOOT1 (out), SYS_BOOT2 (out), SYS_BOOT3 (out), SYS_BOOT4 (out), SYS_BOOT5 (out), SYS_BOOT6 (out), SYS_BOOT7 (out), SYS_BOOT8 (out), SYS_BOOT9 (out), SYS_BOOT10 (out), SYS_BOOT11 (out), SYS_BOOT12 (out), SYS_BOOT13 (out), SYS_BOOT14 (out), SYS_BOOT15 (out)

### Nets
DGND: C500.2 C501.1 CN500.5(GND) Q500.2(S) Q501.2(S) Q502.2(S) Q503.2(S) R501.1 R520.1 R521.2 R522.1 R523.1 R524.1 R525.1 R526.1 R527.1 R528.1 R529.1 R530.1 R531.1 R532.1 R533.1 R534.1 R535.1 R536.1 R537.1 R538.1 R539.2 R544.1 R548.1 R552.1 R556.1 SW500.3 U501.4(GND)
DP1.8V_VRTC: C506.2 R553.1 X501.4(VDD)
DP3.3VS_A: R502.2 R503.2 R504.2 R505.2 R506.2 R507.2 R508.2 R509.2 R510.2 R511.2 R512.2 R513.2 R514.2 R515.2 R516.2 R517.2 R541.2 R547.2 R550.2 R555.2
DP3.3VS_B: R519.1
GNDADC: C503.2 C504.2 C505.1 R545.2
GNDOSC0: C502.1 X500.2(GND)
GNDOSC1: C506.1 X501.2(GND)
USB0_VBUS: C501.2 CN500.1(VBUS) LED500.4(Common_Anode) R500.2 U400.P15(USB0_VBUS) U501.6(VBUS)
USB_5VS: R500.1
VDD_ADC: R542.2
VDD_PLL: C502.2 R543.1 X500.4(VDD)
AIN0: U400.B6(AIN0) ; port AIN0
AIN1: U400.C7(AIN1) ; port AIN1
AIN2: U400.B7(AIN2) ; port AIN2
AIN3: U400.A7(AIN3) ; port AIN3
AIN4: U400.C8(AIN4) ; port AIN4
AIN5: U400.B8(AIN5) ; port AIN5
AIN6: U400.A8(AIN6) ; port AIN6
AM3_PMIC_LDO_PGOOD: U400.B5(~{RTC_PWR_ON_RST}) ; port AM3_PMIC_LDO_PGOOD
AM3_PMIC_nWAKEUP: U400.C5(EXT_WAKEUP) ; port AM3_PMIC_nWAKEUP
AM3_PMIC_PWR_EN: U400.C6(PMIC_POWER_EN) ; port AM3_PMIC_PWR_EN
AM3_USER_LED1: R546.1 ; port AM3_USER_LED1
AM3_USER_LED2: R549.1 ; port AM3_USER_LED2
AM3_USER_LED3: R554.1 ; port AM3_USER_LED3
AM3_USER_LED4: R557.1 ; port AM3_USER_LED4
EXT_CLK_24MHZ: R540.2 U400.V10(XTAL_IN)
EXT_CLK_32.768KHZ: R551.2 U400.A6(RTC_XTAL_IN)
RTC_KALDO_nEN: R539.1 U400.B4(~{RTC_KALDO_EN})
SYS_BOOT0: R517.1 R538.2 ; port SYS_BOOT0
SYS_BOOT1: R516.1 R537.2 ; port SYS_BOOT1
SYS_BOOT2: R515.1 R518.1 R536.2 ; port SYS_BOOT2
SYS_BOOT3: R514.1 R535.2 ; port SYS_BOOT3
SYS_BOOT4: R513.1 R534.2 ; port SYS_BOOT4
SYS_BOOT5: R512.1 R533.2 ; port SYS_BOOT5
SYS_BOOT6: R511.1 R532.2 ; port SYS_BOOT6
SYS_BOOT7: R510.1 R531.2 ; port SYS_BOOT7
SYS_BOOT8: R509.1 R530.2 ; port SYS_BOOT8
SYS_BOOT9: R508.1 R529.2 ; port SYS_BOOT9
SYS_BOOT10: R507.1 R528.2 ; port SYS_BOOT10
SYS_BOOT11: R506.1 R527.2 ; port SYS_BOOT11
SYS_BOOT12: R505.1 R526.2 ; port SYS_BOOT12
SYS_BOOT13: R504.1 R525.2 ; port SYS_BOOT13
SYS_BOOT14: R503.1 R524.2 ; port SYS_BOOT14
SYS_BOOT15: R502.1 R523.2 ; port SYS_BOOT15
USB0_D_N: CN500.2(D-) U400.N18(USB0_DM) U501.2(D-)
USB0_D_P: CN500.3(D+) U400.N17(USB0_DP) U501.1(D+)
USB0_ID: CN500.4(ID) U400.P16(USB0_ID) U501.3(ID)
USB0_SH: C500.1 CN500.S1(SHIELD) CN500.S2(SHIELD) R501.2
USB0_VBUS_LED: LED500.2(GREEN) R521.1
VREFN: R545.1 U400.A9(VREFN)
VREFP: C503.1 C504.1 C505.2 R542.1 U400.B9(VREFP)
NetLED501_3: LED501.3(BLUE) Q500.3(D)
NetLED501_4: LED501.4(Common_Anode) R541.1
NetLED502_3: LED502.3(BLUE) Q501.3(D)
NetLED502_4: LED502.4(Common_Anode) R547.1
NetLED503_3: LED503.3(BLUE) Q502.3(D)
NetLED503_4: LED503.4(Common_Anode) R550.1
NetLED504_3: LED504.3(BLUE) Q503.3(D)
NetLED504_4: LED504.4(Common_Anode) R555.1
NetQ500_1: Q500.1(G) R544.2 R546.2
NetQ501_1: Q501.1(G) R548.2 R549.2
NetQ502_1: Q502.1(G) R552.2 R554.2
NetQ503_1: Q503.1(G) R556.2 R557.2
NetR518_2: R518.2 SW500.1
NetR519_2: R519.2 R520.2 U400.C9(AIN7)
NetR522_2: R522.2 U400.P17(USB1_ID)
NetR540_1: R540.1 X500.3(OUT)
NetR543_2: R543.2 X500.1(EN)
NetR551_1: R551.1 X501.3(OUT)
NetR553_2: R553.2 X501.1(EN)

Not connected (* = marked no-connect by the designer): U400 A4(RTC_XTAL_OUT)* M15(USB0_CE)* P18(USB1_CE)* R17(USB1_DP)* R18(USB1_DM)* T18(USB1_VBUS)* U11(XTAL_OUT)*; U501 5(NC)*

### Layout directives
differential pair; differential pair class USB_Mini_B_DIFF90: USB0_D_N, USB0_D_P

### Notes on the sheet
- Sitara  Project  B'd (Rev.A)
- [5] Sitara AUX Part
- Push       =>  Boot from "Micro SD Card"
- Release   =>  Boot from "eMMC"
- Indication LED (USB0 VBUS)
- BC For LED
- Title
- Rev
- Doc
- Sheet #
- of
- Engineer
- This document is copyright of ArkX and shall not be revealed, produced, copied, in whole or in part,
- Date
- nor used for any purpose other than submitted.
- (in symbol CON_USB2.0-Mini-B) USB2.0 Mini-B
- (in symbol IC_SOC_AM3358BZCZ100, part D) I/O  BANK  :  RTC / OSC / ADC / USB

### Library data of the parts
C500 C503 C504 = CAP_100nF/50V/1005: Ceramic CAP_100nF/50V/1005; LCSC Part #: C307331; JLCPCB Part Type: Basic Part
C501 = CAP_4.7uF/10V/1005: 10V 4.7uF X5R ±20% 0402  Multilayer Ceramic Capacitors MLCC - SMD/SMT ROHS; JLCPCB Part Type: Basic Part; LCSC Part #: C23733
C502 C506 = CAP_100nF/25V/0603: Ceramic CAP_100nF/25V/0603; JLCPCB Part Type: Extended Part; LCSC Part #: C181047
C505 = CAP_1nF/50V/1005: Ceramic CAP_1nF/50V/1005; LCSC Part #: C1523; JLCPCB Part Type: Basic Part
CN500 = CON_USB2.0-Mini-B: USB - mini B USB 2.0 Receptacle Connector 5 Position Surface Mount, Right Angle; LCSC Part #: C2692070; JLCPCB Part Type: Extended Part
LED500 = LED_MHT170RGBCT(GREEN): as LED300 on sheet Power; LCSC Part #: C2962094; JLCPCB Part Type: Extended Part
LED501-LED504 = LED_MHT170RGBCT(BLUE): Colorless transparence -30℃~+85℃ Positive post Common anode RGB 120° 0805  Light Emitting Diodes (LED) ROHS; LCSC Part #: C2962094; JLCPCB Part Type: Extended Part
Q500-Q503 = FET_2N7002: 60V 115mA 200mW 7.5Ω@10V,500mA N Channel SOT-23  MOSFETs ROHS; LCSC Part #: C8545; JLCPCB Part Type: Basic Part
R500 = RES_0R/3216/0.25W: Power Rating: 0.1W; Precision: 1%; Size: 1608; LCSC Part #: C17888; JLCPCB Part Type: Basic Part
R501 = RES_1M/1005/62.5mW: Value: 1M; Power Rating: 62.5mW; Precision: 1%; Size: 1005; LCSC Part #: C26083; JLCPCB Part Type: Basic Part
R502 R504-R511 R516 R517 R524 R533-R536 = RES_NC_100K/1608/0.1W: RES_100K/1608/0.1W; Value: 100K; Power Rating: 0.1W; Precision: 1%; Size: 1608
R503 R512-R515 R523 R525-R532 R537 R538 = RES_100K/1608/0.1W: as R301 on sheet Power; Size: 1608; LCSC Part #: C25803; JLCPCB Part Type: Basic Part
R518 = RES_100R/1608/0.1W: Value: 100R; Power Rating: 0.1W; Precision: 1%; Size: 1608; LCSC Part #: C22775; JLCPCB Part Type: Basic Part
R519 R520 = RES_4.7K/1005/62.5mW: Value: 4.7K; Power Rating: 62.5mW; Precision: 1%; Size: 1005; LCSC Part #: C25900; JLCPCB Part Type: Basic Part
R521 = RES_1K/1608/0.1W: Value: 1K; Power Rating: 0.1W; Precision: 1%; Size: 1608; LCSC Part #: C21190; JLCPCB Part Type: Basic Part
R522 R542 R543 R545 R553 = RES_0R/1608/0.1W: as R322 on sheet Power; Size: 1608; LCSC Part #: C21189; JLCPCB Part Type: Basic Part
R539 = RES_10K/1608/0.1W: Value: 10K; Power Rating: 0.1W; Precision: 1%; Size: 1608; LCSC Part #: C25804; JLCPCB Part Type: Basic Part
R540 R551 = RES_0R/1005/62.5mW: as R308 on sheet Power; Size: 1005; LCSC Part #: C17168; JLCPCB Part Type: Basic Part
R541 R547 R550 R555 = RES_470R/1608/0.1W: Value: 470R; Power Rating: 0.1W; Precision: 1%; Size: 1608; LCSC Part #: C23179; JLCPCB Part Type: Basic Part
R544 R548 R552 R556 = RES_12K/1608/0.1W: Value: 12K; Power Rating: 0.1W; Precision: 1%; Size: 1608; LCSC Part #: C22790; JLCPCB Part Type: Basic Part
R546 R549 R554 R557 = RES_22R/1608/0.1W: Value: 22R; Power Rating: 0.1W; Precision: 1%; Size: 1608; LCSC Part #: C23345; JLCPCB Part Type: Basic Part
SW500 = SW_K2-1102SP-C4SC-04(2P): as SW300 on sheet Power; LCSC Part #: C127509; JLCPCB Part Type: Extended Part
U400 = IC_SOC_AM3358BZCZ100: as U400 on sheet Sitara_Power; LCSC Part #: C73932; JLCPCB Part Type: Extended Part
U501 = DIO_TVS_TPD4S012DRYR: Clamp 3A (8/20µs) Ipp Tvs Diode Surface Mount 6-SON (1.45x1); LCSC Part #: C96506; JLCPCB Part Type: Extended Part
X500 = OSC_SX2M24.000M20F30TNN(24MHz): 1.62V~3.63V ±20ppm 10mA ±30ppm CMOS 24MHz SMD2520-4P  Crystal Oscillators ROHS; LCSC Part #: C2901600; JLCPCB Part Type: Extended Part
X501 = OSC_SX2M32.768KM20F30TNN(32.768kHz): 1.62V~3.63V ±20ppm 90uA ±30ppm CMOS 32.768kHz SMD2520-4P  Crystal Oscillators ROHS; LCSC Part #: C2901603; JLCPCB Part Type: Extended Part

## Sheet Sitara_DDR.SchDoc
size A3; SheetNumber: 6; SheetTotal: 11
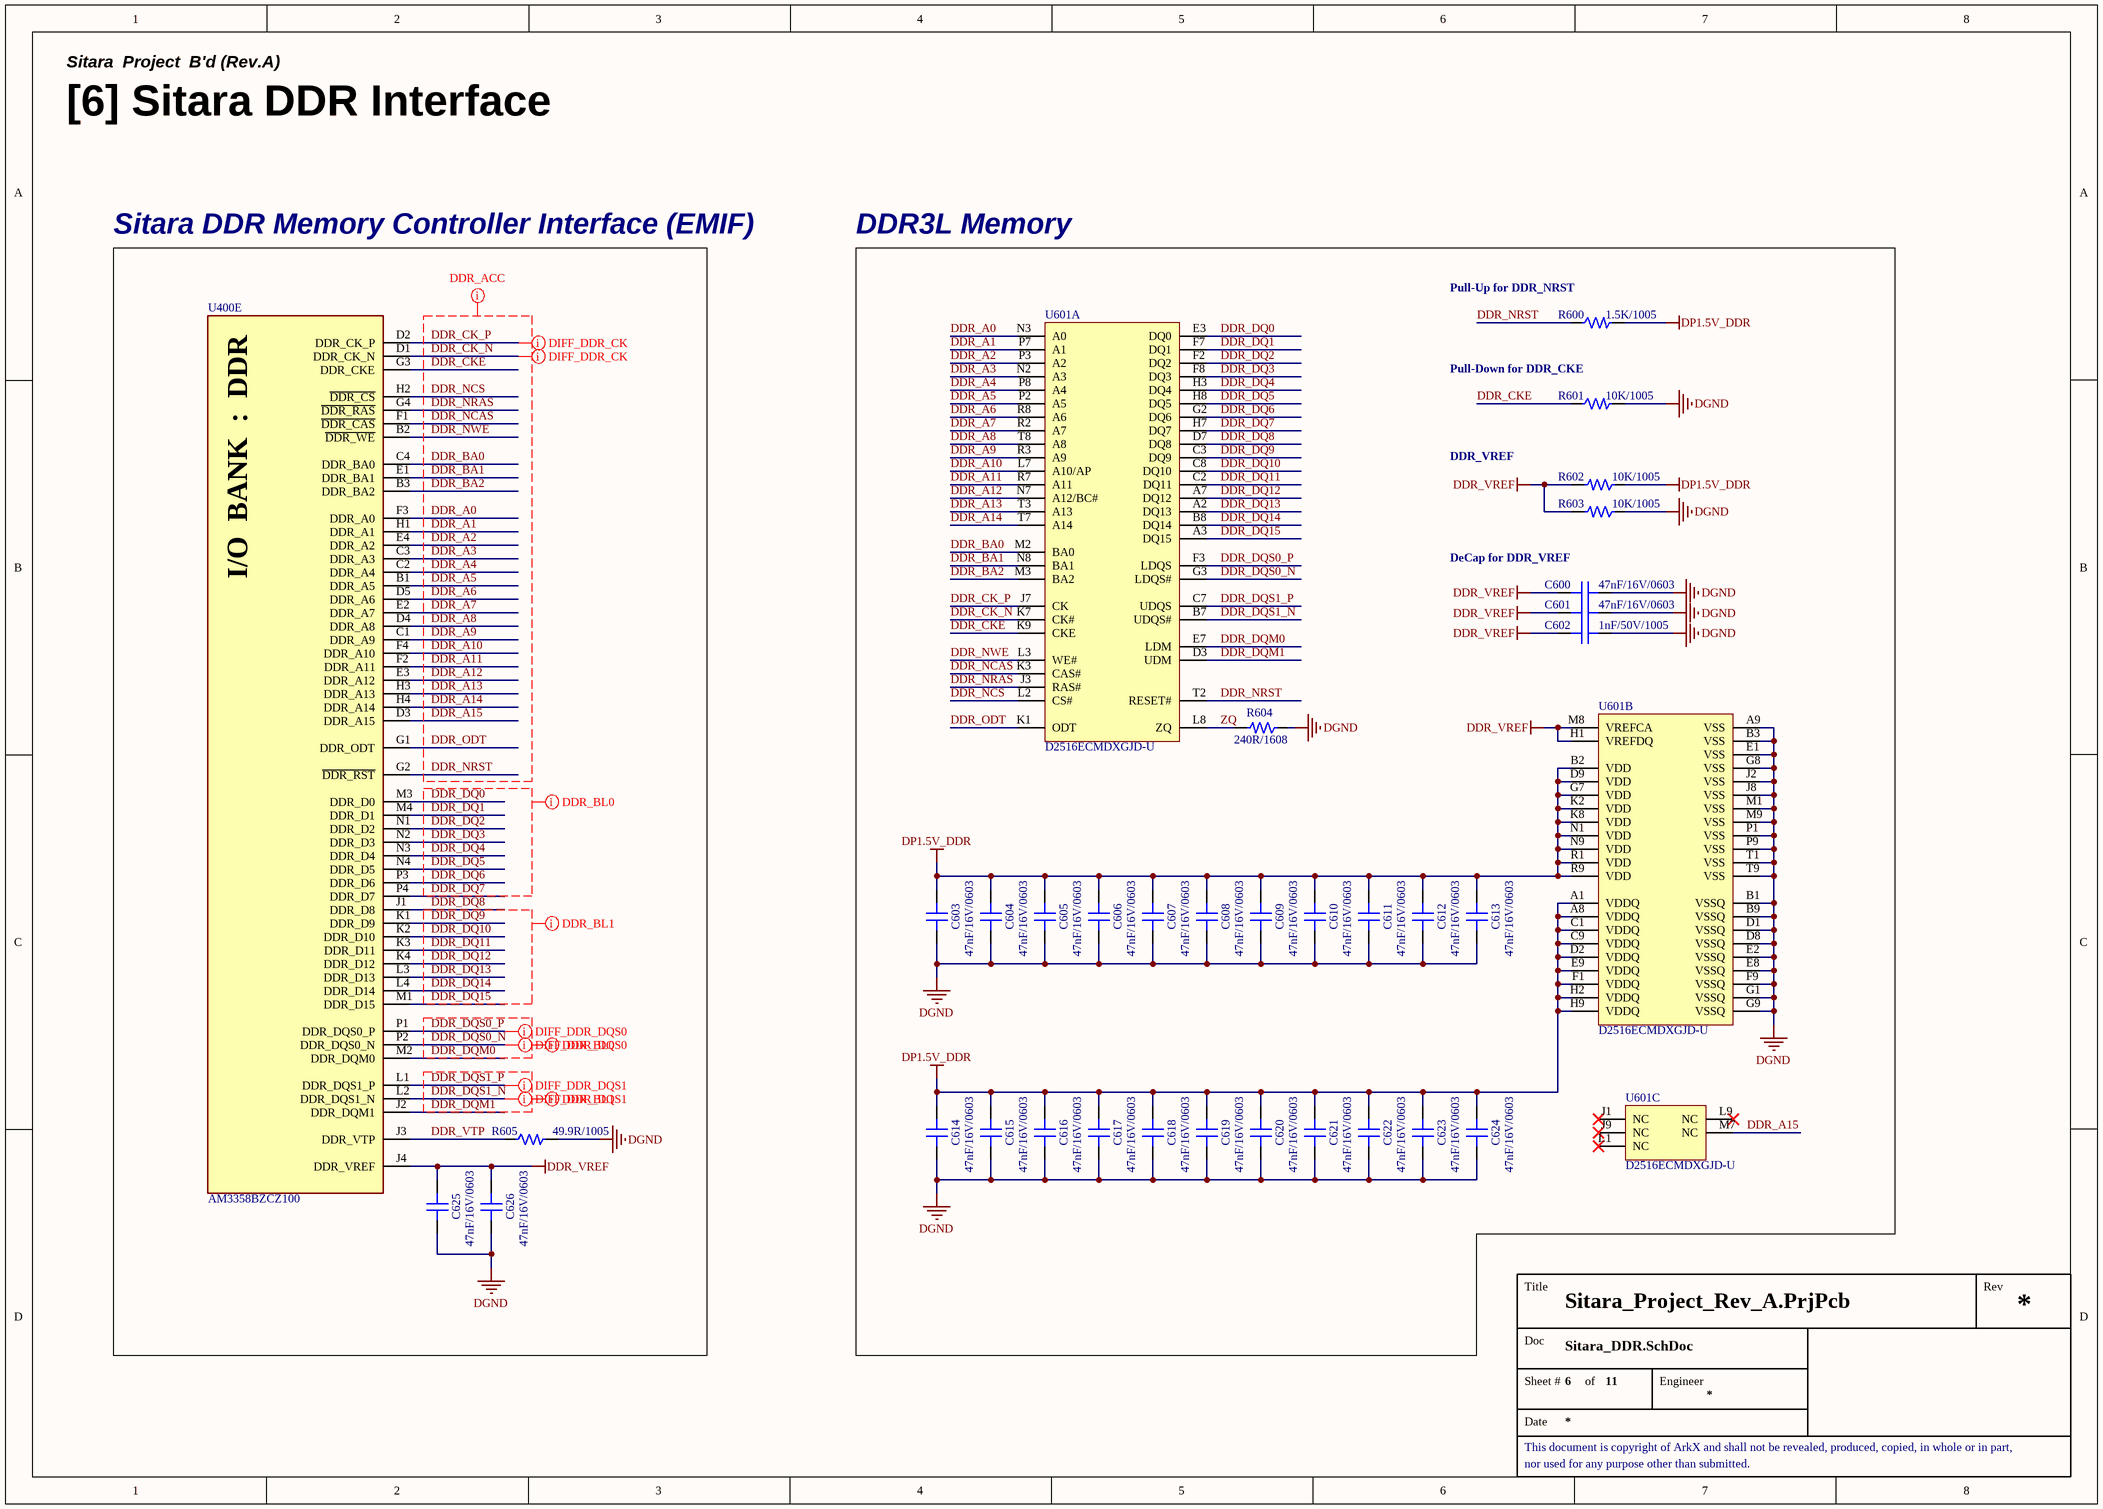
[diagram p5: Sitara_DDR.SchDoc]

### Parts
C600  47nF/16V/0603  [CAP 0603 (0201_INCH)]
C601  47nF/16V/0603  [CAP 0603 (0201_INCH)]
C602  1nF/50V/1005  [CAP 1005 (0402_INCH)]
C603  47nF/16V/0603  [CAP 0603 (0201_INCH)]
C604  47nF/16V/0603  [CAP 0603 (0201_INCH)]
C605  47nF/16V/0603  [CAP 0603 (0201_INCH)]
C606  47nF/16V/0603  [CAP 0603 (0201_INCH)]
C607  47nF/16V/0603  [CAP 0603 (0201_INCH)]
C608  47nF/16V/0603  [CAP 0603 (0201_INCH)]
C609  47nF/16V/0603  [CAP 0603 (0201_INCH)]
C610  47nF/16V/0603  [CAP 0603 (0201_INCH)]
C611  47nF/16V/0603  [CAP 0603 (0201_INCH)]
C612  47nF/16V/0603  [CAP 0603 (0201_INCH)]
C613  47nF/16V/0603  [CAP 0603 (0201_INCH)]
C614  47nF/16V/0603  [CAP 0603 (0201_INCH)]
C615  47nF/16V/0603  [CAP 0603 (0201_INCH)]
C616  47nF/16V/0603  [CAP 0603 (0201_INCH)]
C617  47nF/16V/0603  [CAP 0603 (0201_INCH)]
C618  47nF/16V/0603  [CAP 0603 (0201_INCH)]
C619  47nF/16V/0603  [CAP 0603 (0201_INCH)]
C620  47nF/16V/0603  [CAP 0603 (0201_INCH)]
C621  47nF/16V/0603  [CAP 0603 (0201_INCH)]
C622  47nF/16V/0603  [CAP 0603 (0201_INCH)]
C623  47nF/16V/0603  [CAP 0603 (0201_INCH)]
C624  47nF/16V/0603  [CAP 0603 (0201_INCH)]
C625  47nF/16V/0603  [CAP 0603 (0201_INCH)]
C626  47nF/16V/0603  [CAP 0603 (0201_INCH)]
R600  1.5K/1005  [RES 1005 (0402_inch)]
R601  10K/1005  [RES 1005 (0402_inch)]
R602  10K/1005  [RES 1005 (0402_inch)]
R603  10K/1005  [RES 1005 (0402_inch)]
R604  240R/1608  [RES 1608 (0603_inch)]
R605  49.9R/1005  [RES 1005 (0402_inch)]
U400  AM3358BZCZ100  [IC_SOC_AM3358BZCZ100]  (part E of 8)
U601  D2516ECMDXGJD-U  [IC_MEM_DDR3L_MT41K256M16TW-107 IT:P]  (parts A,B,C of 3)

### Blocks framed on the sheet
Sitara DDR Memory Controller Interface (EMIF): C625 C626 R605 U400
DDR3L Memory: C600-C624 R600-R604 U601

### Nets
DDR_VREF: C600.2 C601.2 C602.2 C625.2 C626.2 R602.2 R603.2 U400.J4(DDR_VREF) U601.H1(VREFDQ) U601.M8(VREFCA)
DGND: C600.1 C601.1 C602.1 C603.1 C604.1 C605.1 C606.1 C607.1 C608.1 C609.1 C610.1 C611.1 C612.1 C613.1 C614.1 C615.1 C616.1 C617.1 C618.1 C619.1 C620.1 C621.1 C622.1 C623.1 C624.1 C625.1 C626.1 R601.2 R603.1 R604.1 R605.2 U601.A9(VSS) U601.B1(VSSQ) U601.B3(VSS) U601.B9(VSSQ) U601.D1(VSSQ) U601.D8(VSSQ) U601.E1(VSS) U601.E2(VSSQ) U601.E8(VSSQ) U601.F9(VSSQ) U601.G1(VSSQ) U601.G8(VSS) U601.G9(VSSQ) U601.J2(VSS) U601.J8(VSS) U601.M1(VSS) U601.M9(VSS) U601.P1(VSS) U601.P9(VSS) U601.T1(VSS) U601.T9(VSS)
DP1.5V_DDR: C603.2 C604.2 C605.2 C606.2 C607.2 C608.2 C609.2 C610.2 C611.2 C612.2 C613.2 C614.2 C615.2 C616.2 C617.2 C618.2 C619.2 C620.2 C621.2 C622.2 C623.2 C624.2 R600.2 R602.1 U601.A1(VDDQ) U601.A8(VDDQ) U601.B2(VDD) U601.C1(VDDQ) U601.C9(VDDQ) U601.D2(VDDQ) U601.D9(VDD) U601.E9(VDDQ) U601.F1(VDDQ) U601.G7(VDD) U601.H2(VDDQ) U601.H9(VDDQ) U601.K2(VDD) U601.K8(VDD) U601.N1(VDD) U601.N9(VDD) U601.R1(VDD) U601.R9(VDD)
DDR_A0: U400.F3(DDR_A0) U601.N3(A0)
DDR_A1: U400.H1(DDR_A1) U601.P7(A1)
DDR_A2: U400.E4(DDR_A2) U601.P3(A2)
DDR_A3: U400.C3(DDR_A3) U601.N2(A3)
DDR_A4: U400.C2(DDR_A4) U601.P8(A4)
DDR_A5: U400.B1(DDR_A5) U601.P2(A5)
DDR_A6: U400.D5(DDR_A6) U601.R8(A6)
DDR_A7: U400.E2(DDR_A7) U601.R2(A7)
DDR_A8: U400.D4(DDR_A8) U601.T8(A8)
DDR_A9: U400.C1(DDR_A9) U601.R3(A9)
DDR_A10: U400.F4(DDR_A10) U601.L7(A10/AP)
DDR_A11: U400.F2(DDR_A11) U601.R7(A11)
DDR_A12: U400.E3(DDR_A12) U601.N7(A12/BC#)
DDR_A13: U400.H3(DDR_A13) U601.T3(A13)
DDR_A14: U400.H4(DDR_A14) U601.T7(A14)
DDR_A15: U400.D3(DDR_A15) U601.M7(NC)
DDR_BA0: U400.C4(DDR_BA0) U601.M2(BA0)
DDR_BA1: U400.E1(DDR_BA1) U601.N8(BA1)
DDR_BA2: U400.B3(DDR_BA2) U601.M3(BA2)
DDR_CK_N: U400.D1(DDR_CK_N) U601.K7(CK#)
DDR_CK_P: U400.D2(DDR_CK_P) U601.J7(CK)
DDR_CKE: R601.1 U400.G3(DDR_CKE) U601.K9(CKE)
DDR_DQ0: U400.M3(DDR_D0) U601.E3(DQ0)
DDR_DQ1: U400.M4(DDR_D1) U601.F7(DQ1)
DDR_DQ2: U400.N1(DDR_D2) U601.F2(DQ2)
DDR_DQ3: U400.N2(DDR_D3) U601.F8(DQ3)
DDR_DQ4: U400.N3(DDR_D4) U601.H3(DQ4)
DDR_DQ5: U400.N4(DDR_D5) U601.H8(DQ5)
DDR_DQ6: U400.P3(DDR_D6) U601.G2(DQ6)
DDR_DQ7: U400.P4(DDR_D7) U601.H7(DQ7)
DDR_DQ8: U400.J1(DDR_D8) U601.D7(DQ8)
DDR_DQ9: U400.K1(DDR_D9) U601.C3(DQ9)
DDR_DQ10: U400.K2(DDR_D10) U601.C8(DQ10)
DDR_DQ11: U400.K3(DDR_D11) U601.C2(DQ11)
DDR_DQ12: U400.K4(DDR_D12) U601.A7(DQ12)
DDR_DQ13: U400.L3(DDR_D13) U601.A2(DQ13)
DDR_DQ14: U400.L4(DDR_D14) U601.B8(DQ14)
DDR_DQ15: U400.M1(DDR_D15) U601.A3(DQ15)
DDR_DQM0: U400.M2(DDR_DQM0) U601.E7(LDM)
DDR_DQM1: U400.J2(DDR_DQM1) U601.D3(UDM)
DDR_DQS0_N: U400.P2(DDR_DQS0_N) U601.G3(LDQS#)
DDR_DQS0_P: U400.P1(DDR_DQS0_P) U601.F3(LDQS)
DDR_DQS1_N: U400.L2(DDR_DQS1_N) U601.B7(UDQS#)
DDR_DQS1_P: U400.L1(DDR_DQS1_P) U601.C7(UDQS)
DDR_NCAS: U400.F1(~{DDR_CAS}) U601.K3(CAS#)
DDR_NCS: U400.H2(~{DDR_CS}) U601.L2(CS#)
DDR_NRAS: U400.G4(~{DDR_RAS}) U601.J3(RAS#)
DDR_NRST: R600.1 U400.G2(~{DDR_RST}) U601.T2(RESET#)
DDR_NWE: U400.B2(~{DDR_WE}) U601.L3(WE#)
DDR_ODT: U400.G1(DDR_ODT) U601.K1(ODT)
DDR_VTP: R605.1 U400.J3(DDR_VTP)
ZQ: R604.2 U601.L8(ZQ)

Not connected (* = marked no-connect by the designer): U601 J1(NC)* J9(NC)* L1(NC)* L9(NC)*

### Layout directives
rule Matched Net Lengths [Delay Tolerance = 10ps]; net class DDR_ACC: DDR_A0, DDR_A1, DDR_A2, DDR_A3, DDR_A4, DDR_A5, DDR_A6, DDR_A7, DDR_A8, DDR_A9, DDR_A10, DDR_A11, DDR_A12, DDR_A13, DDR_A14, DDR_A15, DDR_BA0, DDR_BA1, DDR_BA2, DDR_CK_N, DDR_CK_P, DDR_CKE, DDR_NCAS, DDR_NCS, DDR_NRAS, DDR_NRST, DDR_NWE, DDR_ODT
differential pair; differential pair class DIFF_DDR_CK: DDR_CK_N, DDR_CK_P
differential pair; differential pair class DIFF_DDR_DQS0: DDR_DQS0_N, DDR_DQS0_P
differential pair; differential pair class DIFF_DDR_DQS1: DDR_DQS1_N, DDR_DQS1_P
rule Matched Net Lengths [Delay Tolerance = 10ps]; net class DDR_BL0: DDR_DQ0, DDR_DQ1, DDR_DQ2, DDR_DQ3, DDR_DQ4, DDR_DQ5, DDR_DQ6, DDR_DQ7, DDR_DQM0, DDR_DQS0_N, DDR_DQS0_P
rule Matched Net Lengths [Delay Tolerance = 10ps]; net class DDR_BL1: DDR_DQ8, DDR_DQ9, DDR_DQ10, DDR_DQ11, DDR_DQ12, DDR_DQ13, DDR_DQ14, DDR_DQ15, DDR_DQM1, DDR_DQS1_N, DDR_DQS1_P

### Notes on the sheet
- Sitara  Project  B'd (Rev.A)
- [6] Sitara DDR Interface
- (near R600) Pull-Up for DDR_NRST
- Pull-Down for DDR_CKE
- DDR_VREF
- DeCap for DDR_VREF
- Title
- Rev
- Doc
- Sheet #
- of
- Engineer
- This document is copyright of ArkX and shall not be revealed, produced, copied, in whole or in part,
- Date
- nor used for any purpose other than submitted.
- (in symbol IC_SOC_AM3358BZCZ100, part E) I/O  BANK  :  DDR

### Library data of the parts
C600 C601 C603-C626 = CAP_47nF/16V/0603: 16V 47nF X5R ±10% 0201 Multilayer Ceramic Capacitors MLCC - SMD/SMT ROHS; JLCPCB Part Type: Extended Part; LCSC Part #: C88917
C602 = CAP_1nF/50V/1005: Ceramic CAP_1nF/50V/1005; LCSC Part #: C1523; JLCPCB Part Type: Basic Part
R600 = RES_1.5K/1005/62.5mW: Value: 1.5K; Power Rating: 62.5mW; Precision: 1%; Size: 1005; LCSC Part #: C25867; JLCPCB Part Type: Basic Part
R601-R603 = RES_10K/1005/62.5mW: Value: 10K; Power Rating: 62.5mW; Precision: 1%; Size: 1005; LCSC Part #: C25744; JLCPCB Part Type: Basic Part
R604 = RES_240R/1608/0.1W: Value: 240R; Power Rating: 0.1W; Precision: 1%; Size: 1608; LCSC Part #: C23350; JLCPCB Part Type: Basic Part
R605 = RES_49.9R/1005/62.5mW: Value: 49.9R; Power Rating: 62.5mW; Precision: 1%; Size: 1005; LCSC Part #: C25120; JLCPCB Part Type: Basic Part
U400 = IC_SOC_AM3358BZCZ100: as U400 on sheet Sitara_Power; LCSC Part #: C73932; JLCPCB Part Type: Extended Part
U601 = IC_MEM_DDR3L_D2516ECMDXGJD-U: DRAM 4Gb 96 ball FBGA DDR3L 1866; JLCPCB Part Type: Extended Part; LCSC Part #: C2927180